# Altium project OSP_Carrier_V7_Release.PrjPcb (part 1 of 2)
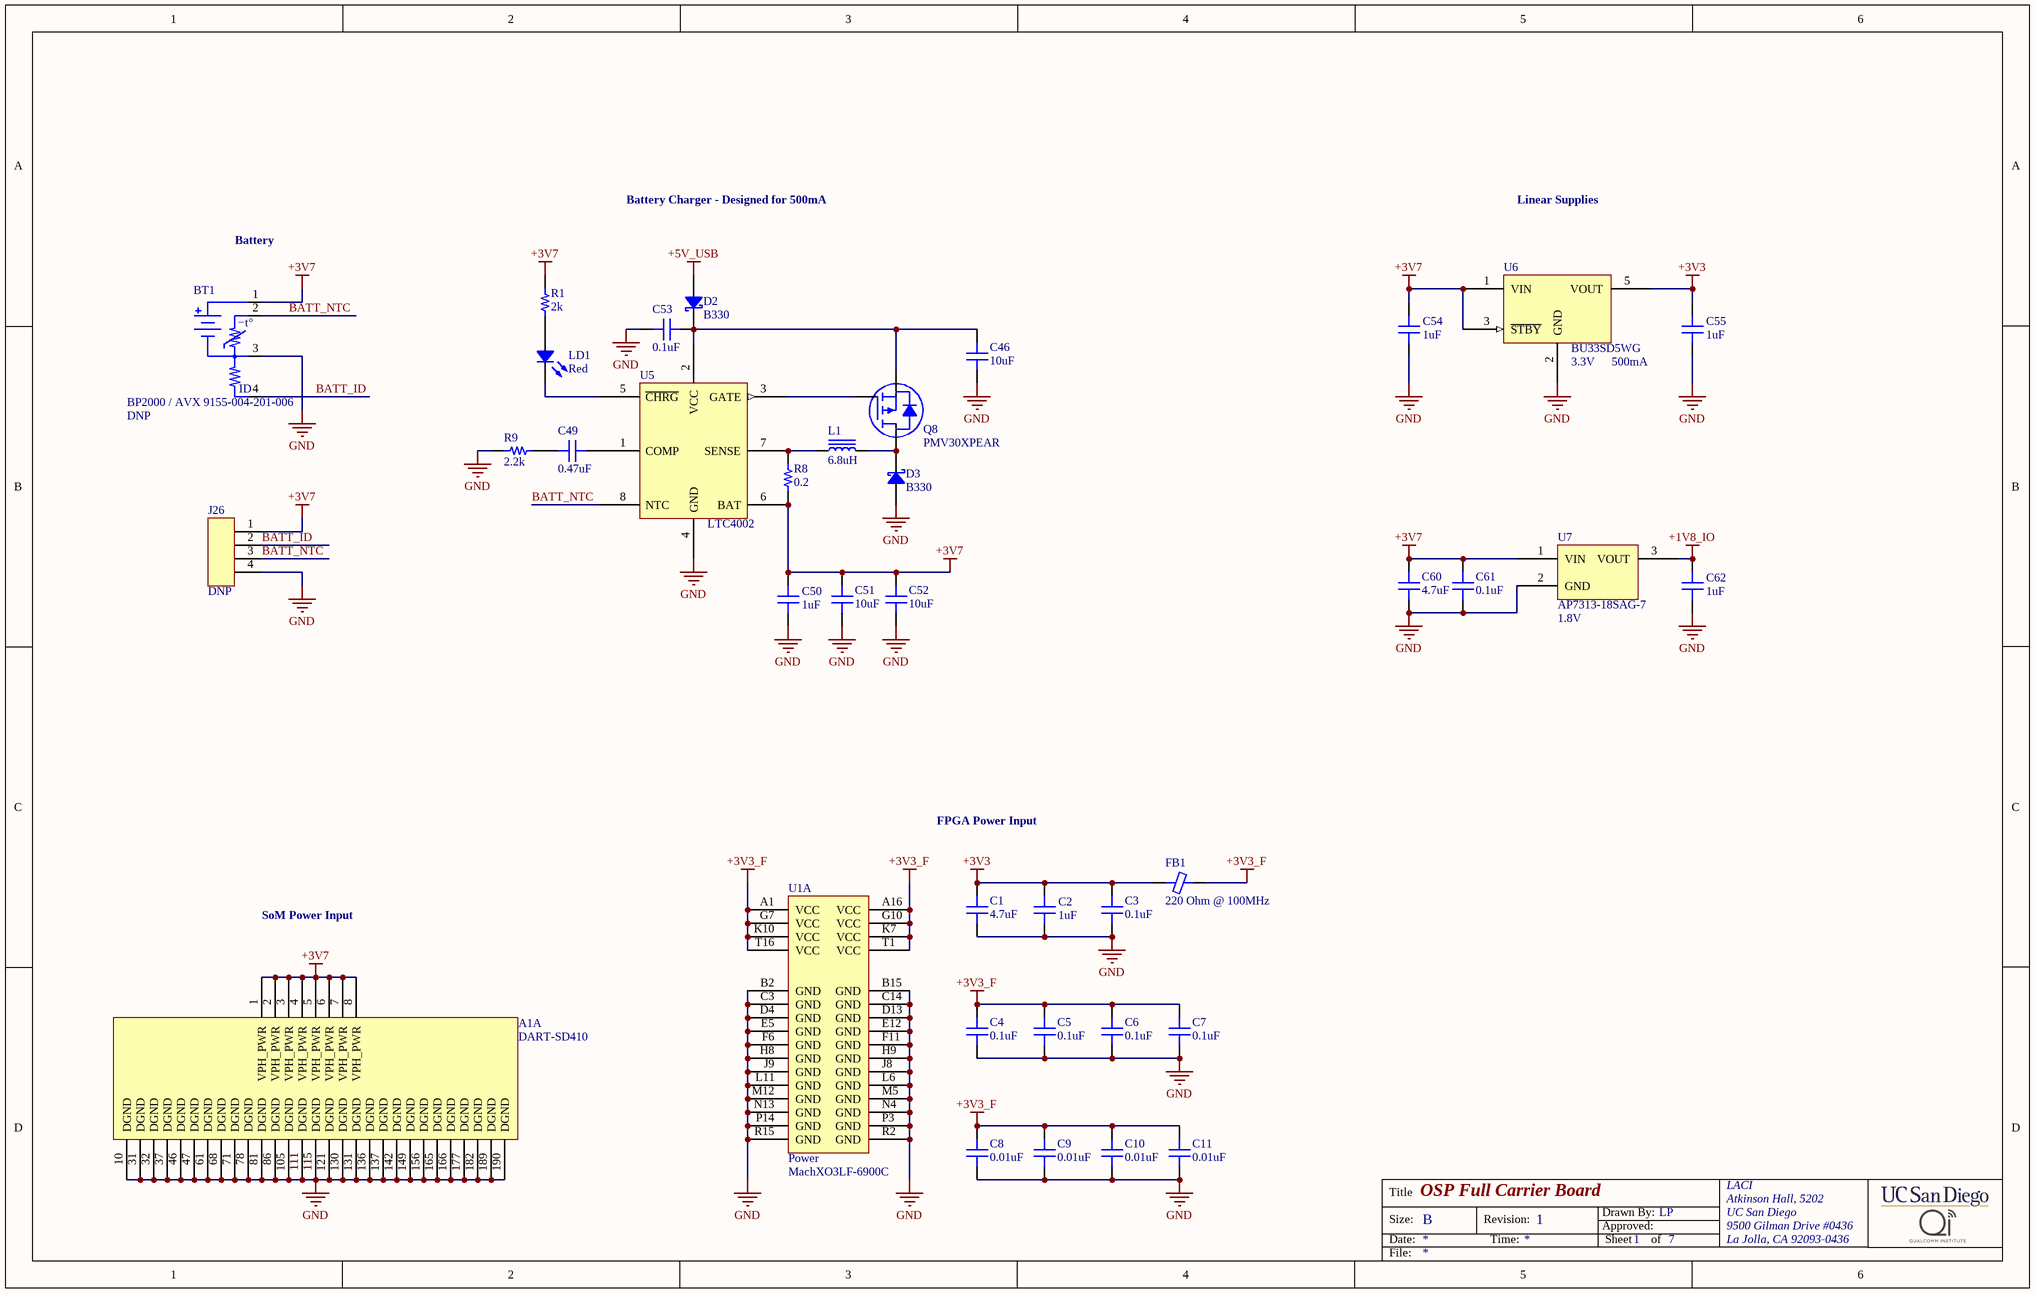
[diagram p0: OSP_Carrier_V7_Release_Power.SchDoc]
6 sheets, 153 parts. Net scope: global (net labels, ports and power ports of the same name join across sheets).
Board file: OSP_Carrier_V7_Release.PcbDoc
Sheets:
  OSP_Carrier_V7_Release_Power.SchDoc
  OSP_Carrier_V7_Release_DJB.SchDoc
  OSP_Carrier_V7_Release_USB.SchDoc
  OSP_Carrier_V7_Release_PMIC_Audio.SchDoc
  OSP_Carrier_V7_Release_Misc.SchDoc
  OSP_Carrier_V7_Release_SD.SchDoc

## Sheet OSP_Carrier_V7_Release_Power.SchDoc: OSP Full Carrier Board
size B; DrawnBy: LP; Revision: 1; SheetNumber: 1; SheetTotal: 7; DocumentName: OSP Full Carrier Board

### Parts
A1  DART-SD410  [DART-SD410]  (part A of 15)
BT1  BP2000 / AVX 9155-004-201-006  [SAMSUNG_BP2000]
C1  4.7uF  [CAP 0402/1005]
C2  1uF  [CAP 0402/1005]
C3  0.1uF  [CAP 0402/1005]
C4  0.1uF  [CAP 0402/1005]
C5  0.1uF  [CAP 0402/1005]
C6  0.1uF  [CAP 0402/1005]
C7  0.1uF  [CAP 0402/1005]
C8  0.01uF  [CAP 0402/1005]
C9  0.01uF  [CAP 0402/1005]
C10  0.01uF  [CAP 0402/1005]
C11  0.01uF  [CAP 0402/1005]
C46  10uF  [CAP 1206/3216]
C49  0.47uF  [CAP 0402/1005]
C50  1uF  [CAP 0402/1005]
C51  10uF  [CAP 1206/3216]
C52  10uF  [CAP 1206/3216]
C53  0.1uF  [CAP 0402/1005]
C54  1uF  [CAP 0402/1005]
C55  1uF  [CAP 0402/1005]
C60  4.7uF  [CAP 0402/1005]
C61  0.1uF  [CAP 0402/1005]
C62  1uF  [CAP 0402/1005]
D2  B330  [DO214AC SMA]
D3  B330  [DO214AC SMA]
FB1  220 Ohm @ 100MHz  [FER 0402/1005]
J26  Shallow  [AMPHENOL_10125839-04RAEHLF_DNP]  (value not drawn)
L1  6.8uH  [LAIRD_TYS6028]
LD1  Red  [LED 0603/1608 RED]
Q8  PMV30XPEAR  [NXP_SOT23]
R1  2k  [RES 0402/1005]
R8  0.2  [STACKPOLE CSR1206]
R9  2.2k  [RES 0402/1005]
U1  MachXO3LF-6900C  [LCMXO3_caBGA_BG256]  (part A of 7)
U5  LTC4002  [AD_LT_S8]
U6  BU33SD5WG  VOLTAGE: 3.3V  CURRENT: 500mA  [ROHM_SSOP5]
U7  AP7313-18SAG-7  Voltage - Output: 1.8V  [DIODES SOT-23-3]

### Nets
+1V8_IO: C62.1 U7.3(VOUT)
+3V3: C1.2 C2.1 C3.2 C55.1 FB1.1 U6.5(VOUT)
+3V3_F: C4.2 C5.2 C6.2 C7.2 C8.2 C9.2 C10.2 C11.2 FB1.2 U1.A1(VCC) U1.A16(VCC) U1.G7(VCC) U1.G10(VCC) U1.K7(VCC) U1.K10(VCC) U1.T1(VCC) U1.T16(VCC)
+3V7: A1.1(VPH_PWR) A1.2(VPH_PWR) A1.3(VPH_PWR) A1.4(VPH_PWR) A1.5(VPH_PWR) A1.6(VPH_PWR) A1.7(VPH_PWR) A1.8(VPH_PWR) BT1.1(+) C50.1 C51.1 C52.1 C54.1 C60.2 C61.2 J26.1 R1.2 R8.1 U5.6(BAT) U6.1(VIN) U6.3(~{STBY}) U7.1(VIN)
+5V_USB: D2.1
GND: A1.10(DGND) A1.31(DGND) A1.32(DGND) A1.37(DGND) A1.46(DGND) A1.47(DGND) A1.61(DGND) A1.68(DGND) A1.71(DGND) A1.78(DGND) A1.81(DGND) A1.86(DGND) A1.105(DGND) A1.111(DGND) A1.115(DGND) A1.121(DGND) A1.130(DGND) A1.131(DGND) A1.136(DGND) A1.137(DGND) A1.142(DGND) A1.149(DGND) A1.156(DGND) A1.165(DGND) A1.166(DGND) A1.177(DGND) A1.182(DGND) A1.189(DGND) A1.190(DGND) BT1.3(−) C1.1 C2.2 C3.1 C4.1 C5.1 C6.1 C7.1 C8.1 C9.1 C10.1 C11.1 C46.2 C50.2 C51.2 C52.2 C53.2 C54.2 C55.2 C60.1 C61.1 C62.2 D3.1 J26.4 R9.2 U1.B2(GND) U1.B15(GND) U1.C3(GND) U1.C14(GND) U1.D4(GND) U1.D13(GND) U1.E5(GND) U1.E12(GND) U1.F6(GND) U1.F11(GND) U1.H8(GND) U1.H9(GND) U1.J8(GND) U1.J9(GND) U1.L6(GND) U1.L11(GND) U1.M5(GND) U1.M12(GND) U1.N4(GND) U1.N13(GND) U1.P3(GND) U1.P14(GND) U1.R2(GND) U1.R15(GND) U5.4(GND) U6.2(GND) U7.2(GND)
BATT_ID: BT1.4(ID) J26.2
BATT_NTC: BT1.2(NTC) J26.3 U5.8(NTC)
NetC46_1: C46.1 C53.1 D2.2 Q8.2(S) U5.2(VCC)
NetC49_1: C49.1 U5.1(COMP)
NetC49_2: C49.2 R9.1
NetD3_2: D3.2 L1.2 Q8.3(D)
NetL1_1: L1.1 R8.2 U5.7(SENSE)
NetLD1_1: LD1.1 R1.1
NetLD1_2: LD1.2 U5.5(~{CHRG})
NetQ8_1: Q8.1(G) U5.3(GATE)

### Notes on the sheet
- Battery Charger - Designed for 500mA
- Linear Supplies
- Battery
- FPGA Power Input
- SoM Power Input
- Title
- Size:
- Date:
- B
- Revision:
- Time:
- Drawn By:
- Approved:
- Sheet
- of
- LACI
- Atkinson Hall, 5202
- UC San Diego
- 9500 Gilman Drive #0436
- La Jolla, CA 92093-0436
- File:
- (in symbol LCMXO3LF-6900C-XBG256X, part A) Power
- (in symbol SAMSUNG_BP2000) −t°

### Library data of the parts
A1 = DART-SD410: Variscite DART-SD410 System on Module
BT1 = SAMSUNG_BP2000: Samsung BP2000 2000mAh battery for Galaxy Camera 2, connector AVX 9155-004-201-006; DNP: DNP
C1 C60 = C1005X5R1A475K050BC: CAP CER 4.7UF 10V X5R 0402; Manufacturer: TDK Corporation; TemperatureRange: -55C ~ 85C; Tolerance: 10%; Value: 4.7uF; Part Number: C1005X5R1A475K050BC; PartId: 12382; Supplier 1: Digi-Key; Supplier Part Number 1: 445-13820-2-ND; ComponentLink1Description: Datasheet; ComponentLink1URL: https://product.tdk.com/info/en/catalog/datasheets/mlcc_commercial_general_en.pdf; ComponentLink2Description: Digi-Key Listing; ComponentLink2URL: https://www.digikey.com/product-detail/en/tdk-corporation/C1005X5R1A475K050BC/445-13820-2-ND/3951056; TemperatureCoefficient: X5R; Voltage: 10V; Price: 0.096; Device Package: 0402 (1005 Metric)
C2 C50 C54 C55 C62 = GRM155R61A105KE15D: CAP CER 1UF 10V X5R 0402; Manufacturer: Murata Electronics North America; TemperatureRange: -55C ~ 85C; Tolerance: 10%; Value: 1uF; Part Number: GRM155R61A105KE15D; PartId: 12338; Supplier 1: Digi-Key; Supplier Part Number 1: 490-3890-2-ND; ComponentLink1Description: Datasheet; ComponentLink1URL: http://www.murata.com/~/media/webrenewal/support/library/catalog/products/capacitor/mlcc/c02e.pdf; ComponentLink2Description: Digi-Key Listing; ComponentLink2URL: https://www.digikey.com/product-detail/en/murata-electronics-north-america/GRM155R61A105KE15D/490-3890-2-ND/965904; TemperatureCoefficient: X5R; Voltage: 10V; Price: 0.0069; Device Package: 0402 (1005 Metric)
C3-C7 C53 C61 = C1005X7R1H104K050BB: CAP CER 0.1UF 50V X7R 0402; Manufacturer: TDK Corporation; TemperatureRange: -55C ~ 125C; Tolerance: 10%; Value: 0.1uF; Part Number: C1005X7R1H104K050BB; PartId: 3860; Supplier 1: Digi-Key; Supplier Part Number 1: 445-5932-2-ND; ComponentLink1Description: Datasheet; ComponentLink1URL: https://product.tdk.com/info/en/catalog/datasheets/mlcc_commercial_general_en.pdf; ComponentLink2Description: Digi-Key listing; ComponentLink2URL: http://digikey.com/product-detail/en/C1005X7R1H104K050BB/445-5932-2-ND/2443410; TemperatureCoefficient: X7R; Voltage: 50V; Price: 0.0287; Type: -; Device Package: 0402 (1005 Metric)
C8-C11 = CC0402KRX7R8BB103: CAP CER 10000PF 25V X7R 0402; Manufacturer: Yageo; TemperatureRange: -55C ~ 125C; Tolerance: 10%; Value: 0.01uF; Part Number: CC0402KRX7R8BB103; PartId: 12361; Supplier 1: Digi-Key; Supplier Part Number 1: 311-1337-2-ND; ComponentLink1Description: Datasheet; ComponentLink1URL: http://www.yageo.com/documents/recent/UPY-GPHC_X7R_6.3V-to-50V_13.pdf; ComponentLink2Description: Digi-Key Listing; ComponentLink2URL: https://www.digikey.com/product-detail/en/yageo/CC0402KRX7R8BB103/311-1337-2-ND/2103075; TemperatureCoefficient: X7R; Voltage: 25V; Price: 0.0017; Device Package: 0402 (1005 Metric)
C46 C51 C52 = C1206C106M3RACTU: CAP CER 10UF 25V X7R 1206; Manufacturer: Kemet; TemperatureRange: -55C ~ 125C; Tolerance: 20%; Value: 10uF; Part Number: C1206C106M3RACTU; PartId: 6235; Supplier 1: Digi-Key; Supplier Part Number 1: 399-7443-2-ND; ComponentLink1Description: Datasheet; ComponentLink1URL: http://www.kemet.com/docfinder?Partnumber=C1206C106M3RACTU; ComponentLink2Description: Digi-Key listing; ComponentLink2URL: http://digikey.com/product-detail/en/C1206C106M3RACTU/399-7443-2-ND/3317649; TemperatureCoefficient: X7R; Voltage: 25V; Price: 0.2272; Type: -; Device Package: 1206 (3216 Metric)
C49 = GRM155R61A474KE15D: CAP CER 0.47UF 10V X5R 0402; Manufacturer: Murata Electronics North America; TemperatureRange: -55C ~ 85C; Tolerance: 10%; Value: 0.47uF; Part Number: GRM155R61A474KE15D; PartId: 12351; Supplier 1: Digi-Key; Supplier Part Number 1: 490-3264-2-ND; ComponentLink1Description: Datasheet; ComponentLink1URL: http://www.murata.com/~/media/webrenewal/support/library/catalog/products/capacitor/mlcc/c02e.pdf; ComponentLink2Description: Digi-Key Listing; ComponentLink2URL: https://www.digikey.com/product-detail/en/murata-electronics-north-america/GRM155R61A474KE15D/490-3264-2-ND/702528; TemperatureCoefficient: X5R; Voltage: 10V; Price: 0.0121; Device Package: 0402 (1005 Metric)
D2 D3 = B330A: B330AE-13 Schottky Diode 3A 30V
FB1 = CIM05U221NC: FERRITE CHIP 220 OHM 500MA 0402; Manufacturer: Samsung Electro-Mechanics America, Inc.; Type: Differential Mode - Single; DC Resistance: 350 mOhm Max; Part Number: CIM05U221NC; PartId: 6444; Value: 220 Ohm @ 100MHz; Supplier 1: Digi-Key; Supplier Part Number 1: 1276-6344-2-ND; ComponentLink1Description: Datasheet; ComponentLink1URL: http://www.samsungsem.com/kr/front/downloadcms.do?path=/kr/support/product-search/bead/__icsFiles/afieldfile/2014/11/13&fileName=S_CIM05J102NC.pdf; ComponentLink2Description: Digi-Key listing; ComponentLink2URL: http://digikey.com/product-detail/en/CIM05U221NC/1276-6344-2-ND/3973776; Price: 0.0073; Device Package: 0402 (1005 Metric); Current Rating: 500mA
J26 = AMPHENOL_10125839-04RAEHLF_DNP: Amphenol 10125839-04RAEHLF (Do Not Populate); DNP: DNP
L1 = Laird_TYS60286R8M-10: Laird TYS60286R8M-10 6.8uH 2.4A 47mOhms
LD1 = LTST-C191KRKT: LED RED CLEAR 0603 SMD; Manufacturer: Lite-On Inc.; Value: Green; Millicandela: 54mcd; Voltage Forward: 2V; Current (Test): 20mA; Viewing Angle: 130; Part Number: LTST-C191KRKT; PartId: 7050; Supplier 1: Digi-Key; Supplier Part Number 1: 160-1447-2-ND; ComponentLink1Description: Datasheet; ComponentLink1URL: http://optoelectronics.liteon.com/upload/download/DS22-2000-223/S_110_LTST-C191KRKT.pdf; ComponentLink2Description: Digi-Key Listing; ComponentLink2URL: http://www.digikey.ca/product-detail/en/LTST-C191KRKT/160-1447-2-ND/386837; Price: 0.0521; Device Package: 0603 (1608 Metric); Colour: Red; Lens Transparency: Clear
Q8 = NXP_PMV30XPEAR: PMV30XPEAR PMOS 20V -5.3A 28mOhms
R1 = ERJ-2RKF2001X: RES SMD 2K OHM 1% 1/10W 0402; Manufacturer: Panasonic Electronic Components; TemperatureRange: -55C ~ 155C; TemperatureCoefficient: 100ppm/C; PowerRating: 0.1W, 1/10W; Value: 2k; Part Number: ERJ-2RKF2001X; PartId: 16; Supplier 1: Digi-Key; Supplier Part Number 1: P2.00KLTR-ND; ComponentLink1Description: Datasheet; ComponentLink1URL: http://industrial.panasonic.com/www-cgi/jvcr13pz.cgi?E+PZ+3+AOA0002+ERJ2RKF2001X+7+WW; ComponentLink2Description: Digikey listing; ComponentLink2URL: http://digikey.com/product-detail/en/ERJ-2RKF2001X/P2.00KLTR-ND/192194; Tolerance: 1%; Price: 0.0043; Type: Thick Film; Device Package: 0402 (1005 Metric)
R8 = CSR1206FKR200: RES SMD 0.2 OHM 1% 1/2W 1206; Manufacturer: Stackpole Electronics Inc.; TemperatureRange: -55C ~ 155C; TemperatureCoefficient: 100ppm/C; PowerRating: 0.5W, 1/2W; Value: 0.2; Part Number: CSR1206FKR200; PartId: 9964; Supplier 1: Digi-Key; Supplier Part Number 1: CSR1206FKR200TR-ND; ComponentLink1Description: Datasheet; ComponentLink1URL: http://www.seielect.com/catalog/SEI-CSR_CSRN.pdf; ComponentLink2Description: Digi-Key Listing; ComponentLink2URL: https://www.digikey.com/product-detail/en/stackpole-electronics-inc/CSR1206FKR200/CSR1206FKR200TR-ND/1742391; Tolerance: 1%; Price: 0.072; Device Package: 1206 (3216 Metric)
R9 = ERJ-2RKF2201X: RES SMD 2.2K OHM 1% 1/10W 0402; Manufacturer: Panasonic Electronic Components; TemperatureRange: -55C ~ 155C; TemperatureCoefficient: 100ppm/C; PowerRating: 0.1W, 1/10W; Value: 2.2k; Part Number: ERJ-2RKF2201X; PartId: 8; Supplier 1: Digi-Key; Supplier Part Number 1: P2.20KLTR-ND; ComponentLink1Description: Datasheet; ComponentLink1URL: http://industrial.panasonic.com/www-cgi/jvcr13pz.cgi?E+PZ+3+AOA0002+ERJ2RKF2201X+7+WW; ComponentLink2Description: Digikey listing; ComponentLink2URL: http://digikey.com/product-detail/en/ERJ-2RKF2201X/P2.20KLTR-ND/1746150; Tolerance: 1%; Price: 0.0043; Type: Thick Film; Device Package: 0402 (1005 Metric)
U1 = LCMXO3LF-6900C-XBG256X: Lattice MachXO3LF-6900C-5BG256C FPGA
U5 = LTC4002: Analog / Linear 1.5A Single Cell Li-Ion Battery Charger
U6 = ROHM_BU33SD5WG: ROHM BU33SD5WG-TR 3.3V 500mA LDO
U7 = AP7313-18SAG-7: IC REG LDO 1.8V 0.15A SOT23-3; Manufacturer: Diodes Incorporated; Topology: Positive Fixed; Voltage - Input: 2 V ~ 6 V; Current - Limit (Min): 200mA; Part Number: AP7313-18SAG-7; PartId: 7912; Supplier 1: Digi-Key; Supplier Part Number 1: AP7313-18SAG-7DITR-ND; ComponentLink1Description: Datasheet; ComponentLink1URL: http://www.diodes.com/_files/datasheets/AP7313.pdf; ComponentLink2Description: Digi-Key Listing; ComponentLink2URL: http://www.digikey.ca/product-detail/en/AP7313-18SAG-7/AP7313-18SAG-7DITR-ND/2270804; Price: 0.1675; Device Package: TO-236-3, SC-59, SOT-23-3; Voltage Dropout: -; Operating Temperature: -40C ~ 85C

## Sheet OSP_Carrier_V7_Release_DJB.SchDoc: OSP Full Carrier Board
size C; DrawnBy: LP; Revision: 1; SheetNumber: 3; SheetTotal: 7
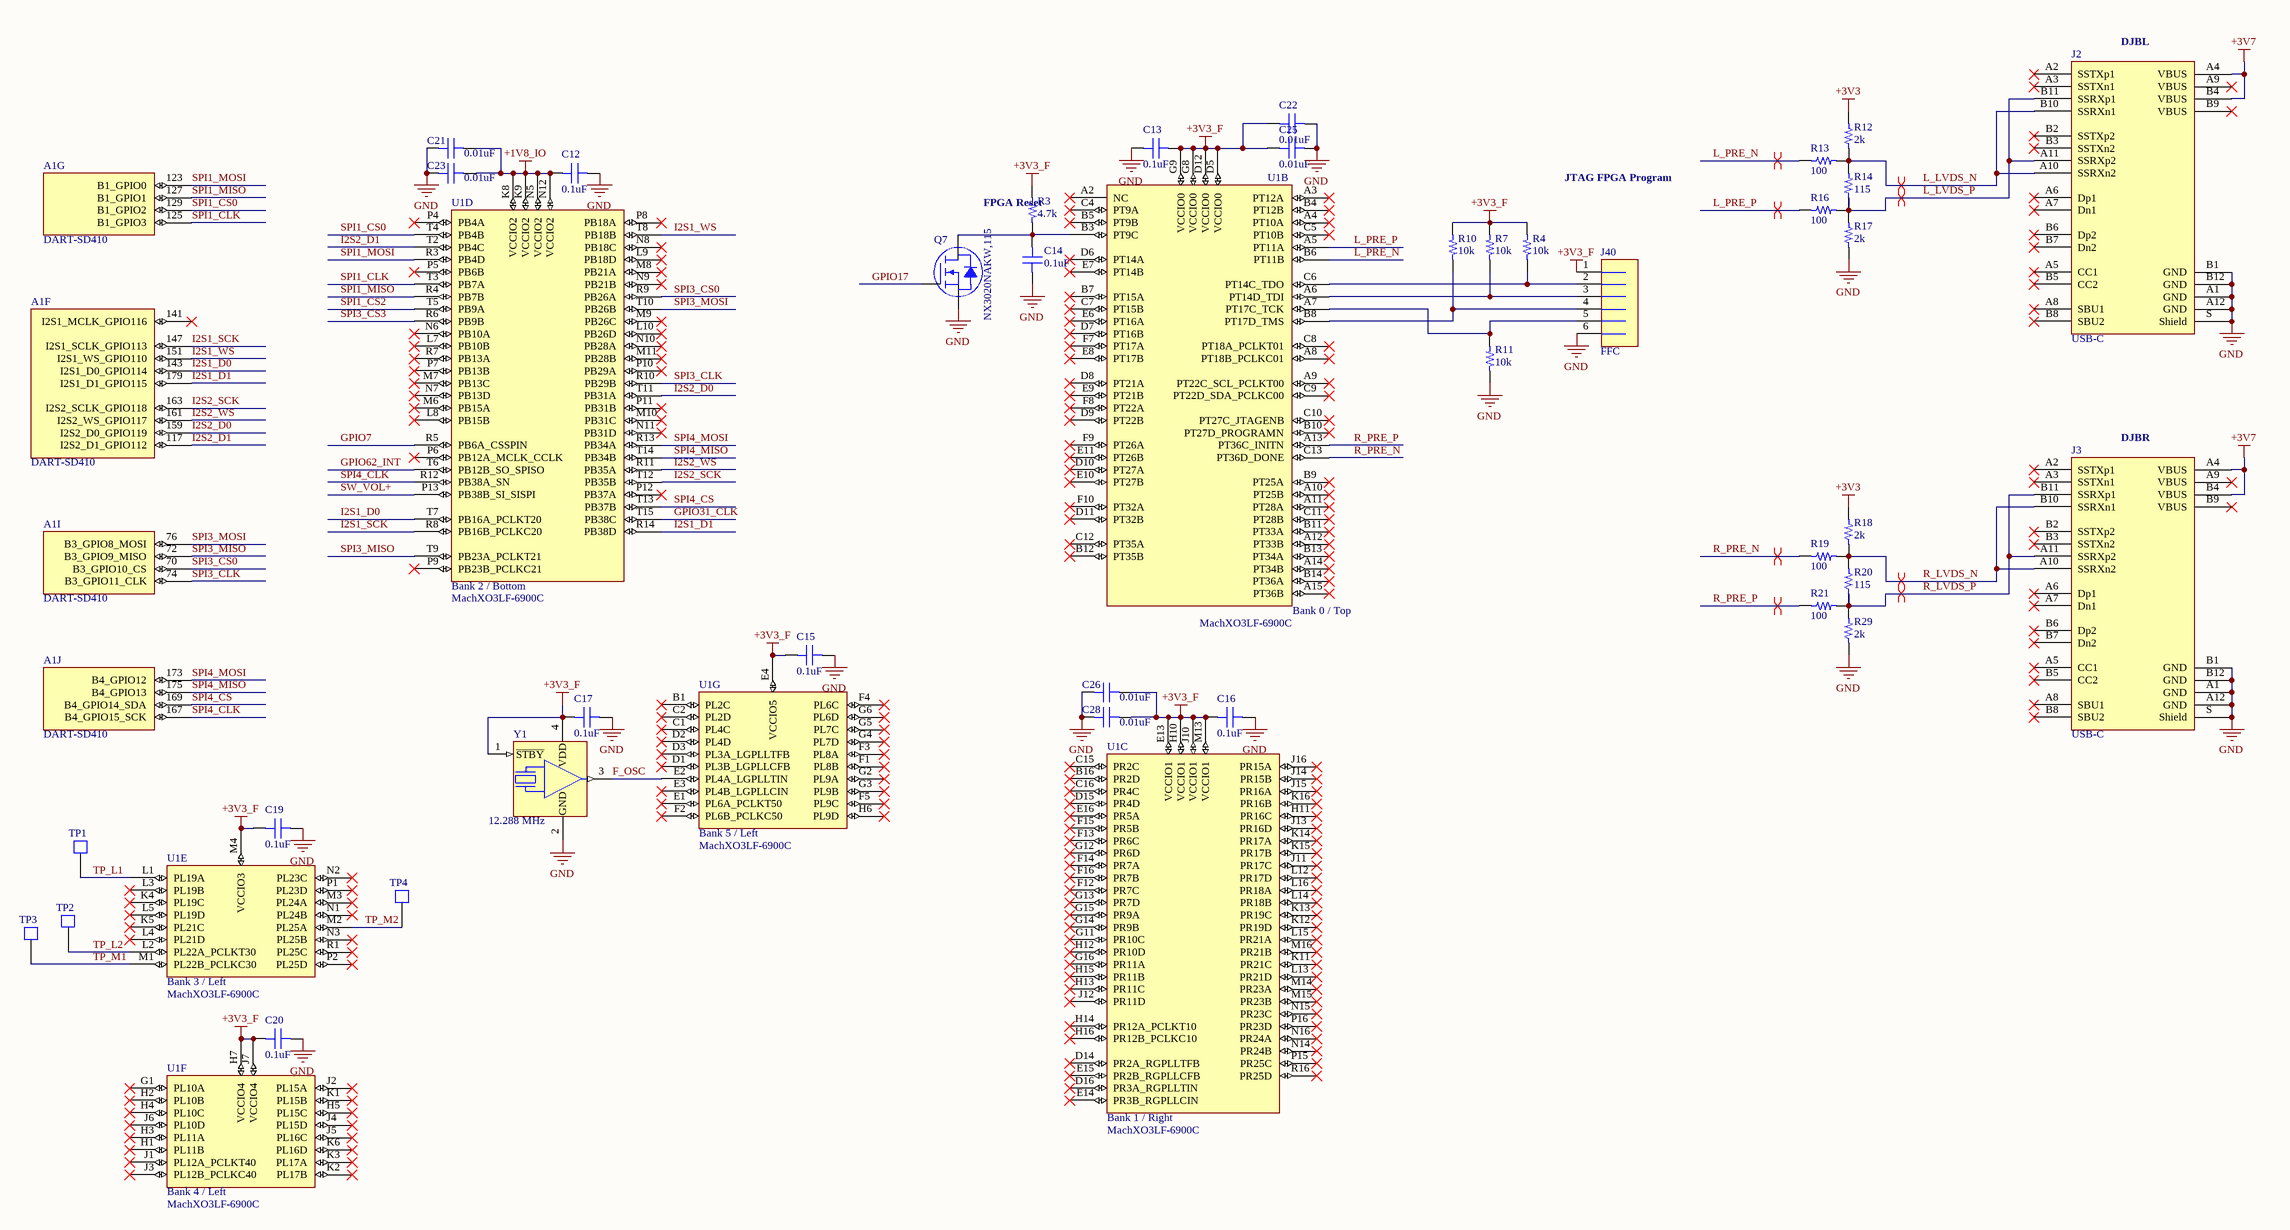
[diagram p1: OSP_Carrier_V7_Release_DJB.SchDoc]

### Parts
A1  DART-SD410  [DART-SD410]  (parts F,G,I,J of 15)
C12  0.1uF  [CAP 0402/1005]
C13  0.1uF  [CAP 0402/1005]
C14  0.1uF  [CAP 0402/1005]
C15  0.1uF  [CAP 0402/1005]
C16  0.1uF  [CAP 0402/1005]
C17  0.1uF  [CAP 0402/1005]
C19  0.1uF  [CAP 0402/1005]
C20  0.1uF  [CAP 0402/1005]
C21  0.01uF  [CAP 0402/1005]
C22  0.01uF  [CAP 0402/1005]
C23  0.01uF  [CAP 0402/1005]
C25  0.01uF  [CAP 0402/1005]
C26  0.01uF  [CAP 0402/1005]
C28  0.01uF  [CAP 0402/1005]
J2  USB-C  [TE_USB-C_2129691-1]
J3  USB-C  [TE_USB-C_2129691-1]
J40  FFC  [AMPHENOL_HFW6R-1STE1LF]
Q7  NX3020NAKW,115  [NXP SOT-323-3]
R3  4.7k  [RES 0402/1005]
R4  10k  [RES 0402/1005]
R7  10k  [RES 0402/1005]
R10  10k  [RES 0402/1005]
R11  10k  [RES 0402/1005]
R12  2k  [RES 0402/1005]
R13  100  [RES 0402/1005]
R14  115  [RES 0402/1005]
R16  100  [RES 0402/1005]
R17  2k  [RES 0402/1005]
R18  2k  [RES 0402/1005]
R19  100  [RES 0402/1005]
R20  115  [RES 0402/1005]
R21  100  [RES 0402/1005]
R29  2k  [RES 0402/1005]
TP1  TP_SMD_1MM_SQ  [TP_SMD_1MM_SQ]  (value not drawn)
TP2  TP_SMD_1MM_SQ  [TP_SMD_1MM_SQ]  (value not drawn)
TP3  TP_SMD_1MM_SQ  [TP_SMD_1MM_SQ]  (value not drawn)
TP4  TP_SMD_1MM_SQ  [TP_SMD_1MM_SQ]  (value not drawn)
U1  MachXO3LF-6900C  [LCMXO3_caBGA_BG256]  (parts B,C,D,E,F,G of 7)
Y1  12.288 MHz  [OSC_2.5x2.0mm]

### Nets
+1V8_IO: C12.2 C21.1 C23.1 U1.K8(VCCIO2) U1.K9(VCCIO2) U1.N5(VCCIO2) U1.N12(VCCIO2)
+3V3: R12.2 R18.2
+3V3_F: C13.2 C15.2 C16.2 C17.2 C19.2 C20.2 C22.1 C25.1 C26.1 C28.1 J40.1 R3.2 R4.2 R7.2 R10.2 U1.D5(VCCIO0) U1.D12(VCCIO0) U1.E4(VCCIO5) U1.E13(VCCIO1) U1.G8(VCCIO0) U1.G9(VCCIO0) U1.H7(VCCIO4) U1.H10(VCCIO1) U1.J7(VCCIO4) U1.J10(VCCIO1) U1.M4(VCCIO3) U1.M13(VCCIO1) Y1.1(~{STBY}) Y1.4(VDD)
+3V7: J2.A4(VBUS) J2.B4(VBUS) J3.A4(VBUS) J3.B4(VBUS)
GND: C12.1 C13.1 C14.2 C15.1 C16.1 C17.1 C19.1 C20.1 C21.2 C22.2 C23.2 C25.2 C26.2 C28.2 J2.A1(GND) J2.A12(GND) J2.B1(GND) J2.B12(GND) J2.S(Shield) J3.A1(GND) J3.A12(GND) J3.B1(GND) J3.B12(GND) J3.S(Shield) J40.6 Q7.3(S) R11.1 R17.1 R29.1 Y1.2(GND)
F_OSC: U1.E2(PL4A_LGPLLTIN) Y1.3(OUT)
GPIO7: U1.R5(PB6A_CSSPIN)
GPIO17: Q7.1(G)
GPIO31_CLK: U1.T15(PB38C)
GPIO62_INT: U1.T6(PB12B_SO_SPISO)
I2S1_D0: A1.143(I2S1_D0_GPIO114) U1.T7(PB16A_PCLKT20)
I2S1_D1: A1.179(I2S1_D1_GPIO115) U1.R14(PB38D)
I2S1_SCK: A1.147(I2S1_SCLK_GPIO113) U1.R8(PB16B_PCLKC20)
I2S1_WS: A1.151(I2S1_WS_GPIO110) U1.T8(PB18B)
I2S2_D0: A1.159(I2S2_D0_GPIO119) U1.T11(PB31A)
I2S2_D1: A1.117(I2S2_D1_GPIO112) U1.T2(PB4C)
I2S2_SCK: A1.163(I2S2_SCLK_GPIO118) U1.T12(PB35B)
I2S2_WS: A1.161(I2S2_WS_GPIO117) U1.R11(PB35A)
L_LVDS_N: J2.A10(SSRXn2) J2.B10(SSRXn1) R12.1 R13.2 R14.2
L_LVDS_P: J2.A11(SSRXp2) J2.B11(SSRXp1) R14.1 R16.2 R17.2
L_PRE_N: R13.1 U1.B6(PT11B)
L_PRE_P: R16.1 U1.A5(PT11A)
R_LVDS_N: J3.A10(SSRXn2) J3.B10(SSRXn1) R18.1 R19.2 R20.2
R_LVDS_P: J3.A11(SSRXp2) J3.B11(SSRXp1) R20.1 R21.2 R29.2
R_PRE_N: R19.1 U1.C13(PT36D_DONE)
R_PRE_P: R21.1 U1.A13(PT36C_INITN)
SPI1_CLK: A1.125(B1_GPIO3) U1.T3(PB7A)
SPI1_CS0: A1.129(B1_GPIO2) U1.T4(PB4B)
SPI1_CS2: U1.T5(PB9A)
SPI1_MISO: A1.127(B1_GPIO1) U1.R4(PB7B)
SPI1_MOSI: A1.123(B1_GPIO0) U1.R3(PB4D)
SPI3_CLK: A1.74(B3_GPIO11_CLK) U1.R10(PB29B)
SPI3_CS0: A1.70(B3_GPIO10_CS) U1.R9(PB26A)
SPI3_CS3: U1.R6(PB9B)
SPI3_MISO: A1.72(B3_GPIO9_MISO) U1.T9(PB23A_PCLKT21)
SPI3_MOSI: A1.76(B3_GPIO8_MOSI) U1.T10(PB26B)
SPI4_CLK: A1.167(B4_GPIO15_SCK) U1.R12(PB38A_SN)
SPI4_CS: A1.169(B4_GPIO14_SDA) U1.T13(PB37B)
SPI4_MISO: A1.175(B4_GPIO13) U1.T14(PB34B)
SPI4_MOSI: A1.173(B4_GPIO12) U1.R13(PB34A)
SW_VOL+: U1.P13(PB38B_SI_SISPI)
TP_L1: TP1.1 U1.L1(PL19A)
TP_L2: TP2.1 U1.L2(PL22A_PCLKT30)
TP_M1: TP3.1 U1.M1(PL22B_PCLKC30)
TP_M2: TP4.1 U1.M2(PL25A)
NetC14_1: C14.1 Q7.2(D) R3.1 U1.B3(PT9C)
NetJ40_2: J40.2 R4.1 U1.C6(PT14C_TDO)
NetJ40_3: J40.3 R7.1 U1.A6(PT14D_TDI)
NetJ40_4: J40.4 R10.1 U1.B8(PT17D_TMS)
NetJ40_5: J40.5 R11.2 U1.A7(PT17C_TCK)

Not connected (* = marked no-connect by the designer): A1 141(I2S1_MCLK_GPIO116)*; J2 A2(SSTXp1)* A3(SSTXn1)* A5(CC1)* A6(Dp1)* A7(Dn1)* A8(SBU1)* A9(VBUS)* B2(SSTXp2)* B3(SSTXn2)* B5(CC2)* B6(Dp2)* B7(Dn2)* B8(SBU2)* B9(VBUS)*; J3 A2(SSTXp1)* A3(SSTXn1)* A5(CC1)* A6(Dp1)* A7(Dn1)* A8(SBU1)* A9(VBUS)* B2(SSTXp2)* B3(SSTXn2)* B5(CC2)* B6(Dp2)* B7(Dn2)* B8(SBU2)* B9(VBUS)*; U1 A2(NC)* A3(PT12A)* A4(PT10A)* A8(PT18B_PCLKC01)* A9(PT22C_SCL_PCLKT00)* A10(PT25B)* A11(PT28A)* A12(PT33B)* A14(PT34B)* A15(PT36B)* B1(PL2C)* B4(PT12B)* B5(PT9B)* B7(PT15A)* B9(PT25A)* B10(PT27D_PROGRAMN)* B11(PT33A)* B12(PT35B)* B13(PT34A)* B14(PT36A)* B16(PR2D)* C1(PL4C)* C2(PL2D)* C4(PT9A)* C5(PT10B)* C7(PT15B)* C8(PT18A_PCLKT01)* C9(PT22D_SDA_PCLKC00)* C10(PT27C_JTAGENB)* C11(PT28B)* C12(PT35A)* C15(PR2C)* C16(PR4C)* D1(PL3B_LGPLLCFB)* D2(PL4D)* D3(PL3A_LGPLLTFB)* D6(PT14A)* D7(PT16B)* D8(PT21A)* D9(PT22B)* D10(PT27A)* D11(PT32B)* D14(PR2A_RGPLLTFB)* D15(PR4D)* D16(PR3A_RGPLLTIN)* E1(PL6A_PCLKT50)* E3(PL4B_LGPLLCIN)* E6(PT16A)* E7(PT14B)* E8(PT17B)* E9(PT21B)* E10(PT27B)* E11(PT26B)* E14(PR3B_RGPLLCIN)* E15(PR2B_RGPLLCFB)* E16(PR5A)* F1(PL8B)* F2(PL6B_PCLKC50)* F3(PL8A)* F4(PL6C)* F5(PL9C)* F7(PT17A)* F8(PT22A)* F9(PT26A)* F10(PT32A)* F12(PR7C)* F13(PR6C)* F14(PR7A)* F15(PR5B)* F16(PR7B)* G1(PL10A)* G2(PL9A)* G3(PL9B)* G4(PL7D)* G5(PL7C)* G6(PL6D)* G11(PR10C)* G12(PR6D)* G13(PR7D)* G14(PR9B)* G15(PR9A)* G16(PR11A)* H1(PL11B)* H2(PL10B)* H3(PL11A)* H4(PL10C)* H5(PL15C)* H6(PL9D)* H11(PR16C)* H12(PR10D)* H13(PR11C)* H14(PR12A_PCLKT10)* H15(PR11B)* H16(PR12B_PCLKC10)* J1(PL12A_PCLKT40)* J2(PL15A)* J3(PL12B_PCLKC40)* J4(PL15D)* J5(PL16C)* J6(PL10D)* J11(PR17C)* J12(PR11D)* J13(PR16D)* J14(PR15B)* J15(PR16A)* J16(PR15A)* K1(PL15B)* K2(PL17B)* K3(PL17A)* K4(PL19C)* K5(PL21C)* K6(PL16D)* K11(PR21C)* K12(PR19D)* K13(PR19C)* K14(PR17A)* K15(PR17B)* K16(PR16B)* L3(PL19B)* L4(PL21D)* L5(PL19D)* L7(PB10B)* L8(PB15B)* L9(PB18D)* L10(PB26D)* L12(PR17D)* L13(PR21D)* L14(PR18B)* L15(PR21A)* L16(PR18A)* M3(PL24A)* M6(PB15A)* M7(PB13C)* M8(PB21A)* M9(PB26C)* M10(PB31C)* M11(PB28B)* M14(PR23A)* M15(PR23B)* M16(PR21B)* N1(PL24B)* N2(PL23C)* N3(PL25B)* N6(PB10A)* N7(PB13D)* N8(PB18C)* N9(PB21B)* N10(PB28A)* N11(PB31D)* N14(PR24B)* N15(PR23C)* N16(PR24A)* P1(PL23D)* P2(PL25D)* P4(PB4A)* P5(PB6B)* P6(PB12A_MCLK_CCLK)* P7(PB13B)* P8(PB18A)* P9(PB23B_PCLKC21)* P10(PB29A)* P11(PB31B)* P12(PB37A)* P15(PR25C)* P16(PR23D)* R1(PL25C)* R7(PB13A)* R16(PR25D)*

### Layout directives
differential pair: L_LVDS_N, L_LVDS_P, L_PRE_N, L_PRE_P, R_LVDS_N, R_LVDS_P, R_PRE_N, R_PRE_P

### Notes on the sheet
- (near J2) DJBL
- FPGA Reset
- JTAG FPGA Program
- (near J3) DJBR
- Title
- Size:
- Date:
- B
- Revision:
- Time:
- Drawn By:
- Approved:
- Sheet
- of
- LACI
- Atkinson Hall, 5202
- UC San Diego
- 9500 Gilman Drive #0436
- La Jolla, CA 92093-0436
- File:
- (in symbol LCMXO3LF-6900C-XBG256X, part B) Bank 0 / Top
- (in symbol LCMXO3LF-6900C-XBG256X, part C) Bank 1 / Right
- (in symbol LCMXO3LF-6900C-XBG256X, part D) Bank 2 / Bottom
- (in symbol LCMXO3LF-6900C-XBG256X, part E) Bank 3 / Left
- (in symbol LCMXO3LF-6900C-XBG256X, part F) Bank 4 / Left
- (in symbol LCMXO3LF-6900C-XBG256X, part G) Bank 5 / Left

### Library data of the parts
A1 = DART-SD410: Variscite DART-SD410 System on Module
C12-C17 C19 C20 = C1005X7R1H104K050BB: as C3 on sheet OSP_Carrier_V7_Release_Power; Value: 0.1uF; Part Number: C1005X7R1H104K050BB; PartId: 3860; Supplier 1: Digi-Key; Supplier Part Number 1: 445-5932-2-ND; ComponentLink1Description: Datasheet; ComponentLink1URL: https://product.tdk.com/info/en/catalog/datasheets/mlcc_commercial_general_en.pdf; ComponentLink2Description: Digi-Key listing; ComponentLink2URL: http://digikey.com/product-detail/en/C1005X7R1H104K050BB/445-5932-2-ND/2443410; TemperatureCoefficient: X7R; Voltage: 50V; Price: 0.0287; Type: -; Device Package: 0402 (1005 Metric)
C21-C23 C25 C26 C28 = CC0402KRX7R8BB103: as C8 on sheet OSP_Carrier_V7_Release_Power; Value: 0.01uF; Part Number: CC0402KRX7R8BB103; PartId: 12361; Supplier 1: Digi-Key; Supplier Part Number 1: 311-1337-2-ND; ComponentLink1Description: Datasheet; ComponentLink1URL: http://www.yageo.com/documents/recent/UPY-GPHC_X7R_6.3V-to-50V_13.pdf; ComponentLink2Description: Digi-Key Listing; ComponentLink2URL: https://www.digikey.com/product-detail/en/yageo/CC0402KRX7R8BB103/311-1337-2-ND/2103075; TemperatureCoefficient: X7R; Voltage: 25V; Price: 0.0017; Device Package: 0402 (1005 Metric)
J2 J3 = TE_USB_C_2129691-1: TE 2129691-1 USB-C Socket
J40 = AMPHENOL_HFW6R-1STE1LF: Amphenol HFW6R-1STE1LF 6-pin flat flexible cable connector
Q7 = NX3020NAKW,115: MOSFET N-CH 30V 180MA SOT323; Part Number: NX3020NAKW,115
R3 = ERJ-2RKF4701X: RES SMD 4.7K OHM 1% 1/10W 0402; Manufacturer: Panasonic Electronic Components; TemperatureRange: -55C ~ 155C; TemperatureCoefficient: 100ppm/C; PowerRating: 0.1W, 1/10W; Value: 4.7k; Part Number: ERJ-2RKF4701X; PartId: 5; Supplier 1: Digi-Key; Supplier Part Number 1: P4.70KLTR-ND; ComponentLink1Description: Datasheet; ComponentLink1URL: http://industrial.panasonic.com/www-cgi/jvcr13pz.cgi?E+PZ+3+AOA0002+ERJ2RKF4701X+7+WW; ComponentLink2Description: Digikey listing; ComponentLink2URL: http://digikey.com/product-detail/en/ERJ-2RKF4701X/P4.70KLTR-ND/1746231; Tolerance: 1%; Price: 0.0043; Type: Thick Film; Device Package: 0402 (1005 Metric)
R4 R7 R10 R11 = ERJ-2RKF1002X: RES SMD 10K OHM 1% 1/10W 0402; Manufacturer: Panasonic Electronic Components; TemperatureRange: -55C ~ 155C; TemperatureCoefficient: 100ppm/C; PowerRating: 0.1W, 1/10W; Value: 10k; Part Number: ERJ-2RKF1002X; PartId: 1; Supplier 1: Digi-Key; Supplier Part Number 1: P10.0KLTR-ND; ComponentLink1Description: Datasheet; ComponentLink1URL: http://industrial.panasonic.com/www-cgi/jvcr13pz.cgi?E+PZ+3+AOA0002+ERJ2RKF1002X+7+WW; ComponentLink2Description: Digikey listing; ComponentLink2URL: http://digikey.com/product-detail/en/ERJ-2RKF1002X/P10.0KLTR-ND/192073; Tolerance: 1%; Price: 0.0043; Type: Thick Film; Device Package: 0402 (1005 Metric)
R12 R17 R18 R29 = ERJ-2RKF2001X: as R1 on sheet OSP_Carrier_V7_Release_Power; Value: 2k; Part Number: ERJ-2RKF2001X; PartId: 16; Supplier 1: Digi-Key; Supplier Part Number 1: P2.00KLTR-ND; ComponentLink1Description: Datasheet; ComponentLink1URL: http://industrial.panasonic.com/www-cgi/jvcr13pz.cgi?E+PZ+3+AOA0002+ERJ2RKF2001X+7+WW; ComponentLink2Description: Digikey listing; ComponentLink2URL: http://digikey.com/product-detail/en/ERJ-2RKF2001X/P2.00KLTR-ND/192194; Tolerance: 1%; Price: 0.0043; Type: Thick Film; Device Package: 0402 (1005 Metric)
R13 R16 R19 R21 = ERJ-2RKF1000X: RES SMD 100 OHM 1% 1/10W 0402; Manufacturer: Panasonic Electronic Components; TemperatureRange: -55C ~ 155C; TemperatureCoefficient: 100ppm/C; PowerRating: 0.1W, 1/10W; Value: 100; Part Number: ERJ-2RKF1000X; PartId: 3; Supplier 1: Digi-Key; Supplier Part Number 1: P100LTR-ND; ComponentLink1Description: Datasheet; ComponentLink1URL: http://industrial.panasonic.com/www-cgi/jvcr13pz.cgi?E+PZ+3+AOA0002+ERJ2RKF1000X+7+WW; ComponentLink2Description: Digikey listing; ComponentLink2URL: http://digikey.com/product-detail/en/ERJ-2RKF1000X/P100LTR-ND/192080; Tolerance: 1%; Price: 0.0043; Type: Thick Film; Device Package: 0402 (1005 Metric)
R14 R20 = ERJ-2RKF1150X: RES SMD 115 OHM 1% 1/10W 0402; Manufacturer: Panasonic Electronic Components; TemperatureRange: -55C ~ 155C; TemperatureCoefficient: 100ppm/C; PowerRating: 0.1W, 1/10W; Value: 115; Part Number: ERJ-2RKF1150X; PartId: 127; Supplier 1: Digi-Key; Supplier Part Number 1: P115LTR-ND; ComponentLink1Description: Datasheet; ComponentLink1URL: http://industrial.panasonic.com/www-cgi/jvcr13pz.cgi?E+PZ+3+AOA0002+ERJ2RKF1150X+7+WW; ComponentLink2Description: Digikey listing; ComponentLink2URL: http://digikey.com/product-detail/en/ERJ-2RKF1150X/P115LTR-ND/192100; Tolerance: 1%; Price: 0.0035; Type: Thick Film; Device Package: 0402 (1005 Metric)
TP1-TP4 = TP_SMD_1MM_SQ: 1mm Square SMD Test Point; DNP: DNP
U1 = LCMXO3LF-6900C-XBG256X: Lattice MachXO3LF-6900C-5BG256C FPGA
Y1 = MC_DSC1033DI2-012.2880: Microchip 12.288 MHz SMD MEMS Oscillator; DIGIKEY_PN: DSC1033DI2-012.2880-ND

## Sheet OSP_Carrier_V7_Release_USB.SchDoc: OSP Full Carrier Board
size B; DrawnBy: LP; Revision: 1; SheetNumber: 4; SheetTotal: 7
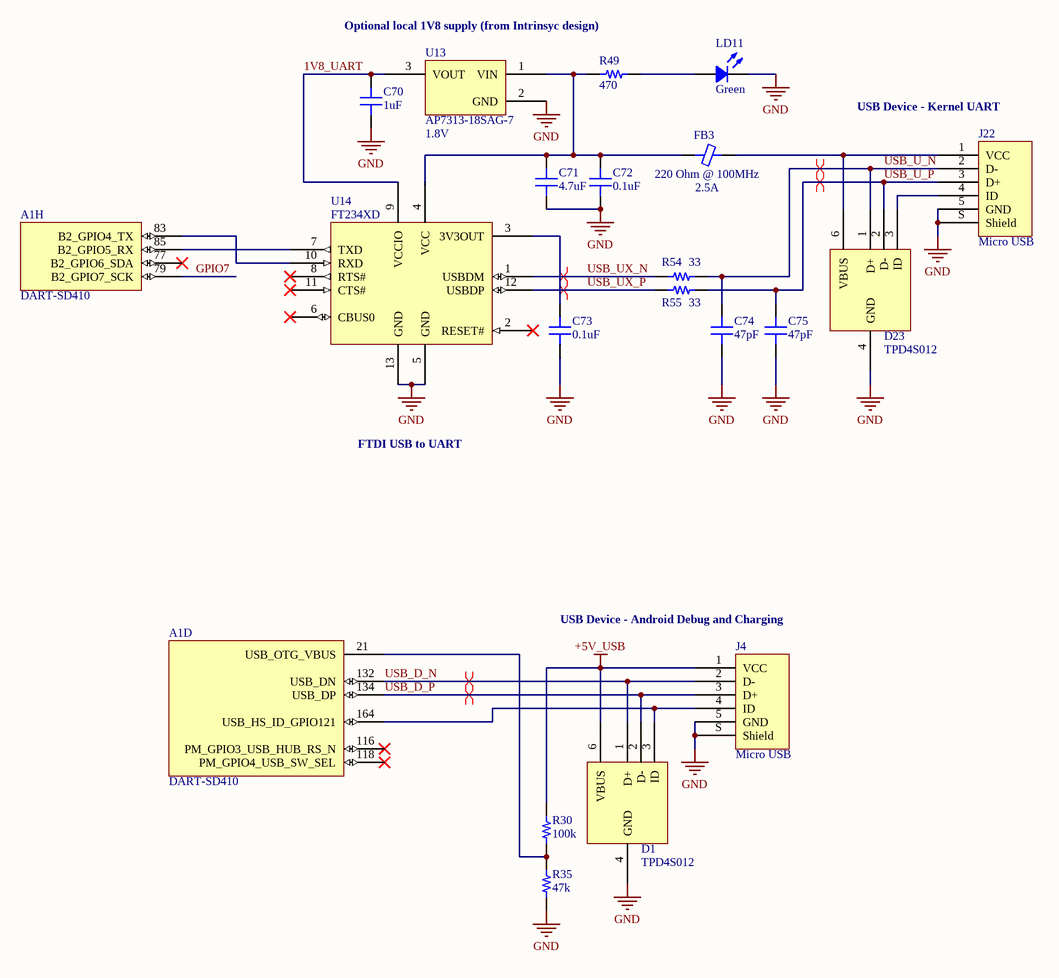
[diagram p2: OSP_Carrier_V7_Release_USB.SchDoc]

### Parts
A1  DART-SD410  [DART-SD410]  (parts D,H of 15)
C70  1uF  [CAP 0603/1608]
C71  4.7uF  [CAP 0402/1005]
C72  0.1uF  [CAP 0402/1005]
C73  0.1uF  [CAP 0402/1005]
C74  47pF  [CAP 0402/1005]
C75  47pF  [CAP 0402/1005]
D1  TPD4S012  [TI_SON6]
D23  TPD4S012  [TI_SON6]
FB3  220 Ohm @ 100MHz  Current Rating: 2.5A  [FER 0603/1608]
J4  Micro USB  [FCI USB 10118193-0001LF]
J22  Micro USB  [FCI USB 10118193-0001LF]
LD11  Green  [LED 0603/1608 GREEN]
R30  100k  [RES 0402/1005]
R35  47k  [RES 0402/1005]
R49  470  [RES 0402/1005]
R54  33  [RES 0402/1005]
R55  33  [RES 0402/1005]
U13  AP7313-18SAG-7  Voltage - Output: 1.8V  [DIODES SOT-23-3]
U14  FT234XD  [FTDI_DFN12]

### Nets
+5V_USB: D1.6(VBUS) J4.1(VCC) R30.2
GND: C70.1 C71.1 C72.1 C73.1 C74.1 C75.1 D1.4(GND) D23.4(GND) J4.5(GND) J4.S(Shield) J22.5(GND) J22.S(Shield) LD11.2 R35.1 U13.2(GND) U14.5(GND) U14.13(GND)
1V8_UART: C70.2 U13.3(VOUT) U14.9(VCCIO)
GPIO7: A1.79(B2_GPIO7_SCK)
USB_D_N: A1.132(USB_DN) D1.1(D+) J4.2(D-)
USB_D_P: A1.134(USB_DP) D1.2(D-) J4.3(D+)
USB_U_N: C74.2 D23.1(D+) J22.2(D-) R54.2
USB_U_P: C75.2 D23.2(D-) J22.3(D+) R55.2
USB_UX_N: R54.1 U14.1(USBDM)
USB_UX_P: R55.1 U14.12(USBDP)
NetA1_21: A1.21(USB_OTG_VBUS) R30.1 R35.2
NetA1_83: A1.83(B2_GPIO4_TX) U14.10(RXD)
NetA1_85: A1.85(B2_GPIO5_RX) U14.7(TXD)
NetA1_164: A1.164(USB_HS_ID_GPIO121) D1.3(ID) J4.4(ID)
NetC71_2: C71.2 C72.2 FB3.1 R49.1 U13.1(VIN) U14.4(VCC)
NetC73_2: C73.2 U14.3(3V3OUT)
NetD23_3: D23.3(ID) J22.4(ID)
NetD23_6: D23.6(VBUS) FB3.2 J22.1(VCC)
NetLD11_1: LD11.1 R49.2

Not connected (* = marked no-connect by the designer): A1 77(B2_GPIO6_SDA)* 116(PM_GPIO3_USB_HUB_RS_N)* 118(PM_GPIO4_USB_SW_SEL)*; U14 2(RESET#)* 6(CBUS0)* 8(RTS#)* 11(CTS#)*

### Layout directives
differential pair: USB_D_N, USB_D_P, USB_U_N, USB_U_P, USB_UX_N, USB_UX_P

### Notes on the sheet
- Optional local 1V8 supply (from Intrinsyc design)
- (near J22) USB Device - Kernel UART
- FTDI USB to UART
- (near J4) USB Device - Android Debug and Charging
- Title
- Size:
- Date:
- B
- Revision:
- Time:
- Drawn By:
- Approved:
- Sheet
- of
- LACI
- Atkinson Hall, 5202
- UC San Diego
- 9500 Gilman Drive #0436
- La Jolla, CA 92093-0436
- File:

### Library data of the parts
A1 = DART-SD410: Variscite DART-SD410 System on Module
C70 = C1608X7R1E105K080AB: CAP CER 1UF 25V X7R 0603; Manufacturer: TDK Corporation; TemperatureRange: -55C ~ 125C; Tolerance: 10%; Value: 1uF; Part Number: C1608X7R1E105K080AB; PartId: 4041; Supplier 1: Digi-Key; Supplier Part Number 1: 445-5956-1-ND; ComponentLink1Description: Datasheet; ComponentLink1URL: https://product.tdk.com/info/en/catalog/datasheets/mlcc_commercial_general_en.pdf; ComponentLink2Description: Digi-Key listing; ComponentLink2URL: http://digikey.com/product-detail/en/C1608X7R1E105K080AB/445-5956-1-ND/2443997; TemperatureCoefficient: X7R; Voltage: 25V; Price: 0.27; Type: -; Device Package: 0603 (1608 Metric)
C71 = C1005X5R1A475K050BC: as C1 on sheet OSP_Carrier_V7_Release_Power; Value: 4.7uF; Part Number: C1005X5R1A475K050BC; PartId: 12382; Supplier 1: Digi-Key; Supplier Part Number 1: 445-13820-2-ND; ComponentLink1Description: Datasheet; ComponentLink1URL: https://product.tdk.com/info/en/catalog/datasheets/mlcc_commercial_general_en.pdf; ComponentLink2Description: Digi-Key Listing; ComponentLink2URL: https://www.digikey.com/product-detail/en/tdk-corporation/C1005X5R1A475K050BC/445-13820-2-ND/3951056; TemperatureCoefficient: X5R; Voltage: 10V; Price: 0.096; Device Package: 0402 (1005 Metric)
C72 C73 = C1005X7R1H104K050BB: as C3 on sheet OSP_Carrier_V7_Release_Power; Value: 0.1uF; Part Number: C1005X7R1H104K050BB; PartId: 3860; Supplier 1: Digi-Key; Supplier Part Number 1: 445-5932-2-ND; ComponentLink1Description: Datasheet; ComponentLink1URL: https://product.tdk.com/info/en/catalog/datasheets/mlcc_commercial_general_en.pdf; ComponentLink2Description: Digi-Key listing; ComponentLink2URL: http://digikey.com/product-detail/en/C1005X7R1H104K050BB/445-5932-2-ND/2443410; TemperatureCoefficient: X7R; Voltage: 50V; Price: 0.0287; Type: -; Device Package: 0402 (1005 Metric)
C74 C75 = C1005C0G1H470G050BA: CAP CER 47PF 50V C0G 0402; Manufacturer: TDK Corporation; TemperatureRange: -55C ~ 125C; TemperatureCoefficient: C0G, NP0; Tolerance: 2%; Value: 47pF; Part Number: C1005C0G1H470G050BA; PartId: 3864; Supplier 1: Digi-Key; Supplier Part Number 1: 445-5364-2-ND; ComponentLink1Description: Datasheet; ComponentLink1URL: https://product.tdk.com/info/en/catalog/datasheets/mlcc_commercial_general_en.pdf; ComponentLink2Description: Digi-Key listing; ComponentLink2URL: http://digikey.com/product-detail/en/C1005C0G1H470G050BA/445-5364-2-ND/2269858; Voltage: 50V; Price: 0.1148; Type: -; Device Package: 0402 (1005 Metric)
D1 D23 = TI_TPD4S012: TI TPD4S012 USB ESD Protection
FB3 = CIS10P221NC: FERRITE CHIP 220 OHM 2500MA 0603; Manufacturer: Samsung Electro-Mechanics America, Inc.; Type: Differential Mode - Single; DC Resistance: 50 mOhm Max; Part Number: CIS10P221NC; PartId: 6665; Value: 220 Ohm @ 100MHz; Supplier 1: Digi-Key; Supplier Part Number 1: 1276-6350-2-ND; ComponentLink1Description: Datasheet; ComponentLink1URL: http://media.digikey.com/pdf/Data%20Sheets/Samsung%20PDFs/CIS10P.pdf; ComponentLink2Description: Digi-Key listing; ComponentLink2URL: http://digikey.com/product-detail/en/CIS10P221NC/1276-6350-2-ND/3973857; Price: 0.031; Device Package: 0603 (1608 Metric)
J4 J22 = 10118193-0001LF: CONN USB MICRO B RECPT SMT R/A; Part Number: 10118193-0001LF
LD11 = LTST-C191KGKT: LED GREEN CLEAR 0603 SMD; Manufacturer: Lite-On Inc.; Type: Surface Mount; Millicandela: 35mcd; Voltage Forward: 2V; Current (Test): 20mA; Viewing Angle: 130; Value: Green; Part Number: LTST-C191KGKT; PartId: 7051; Supplier 1: Digi-Key; Supplier Part Number 1: 160-1446-2-ND; ComponentLink1Description: Datasheet; ComponentLink1URL: http://optoelectronics.liteon.com/upload/download/DS22-2000-228/S_110_LTST-C191KGKT.pdf; ComponentLink2Description: Digi-Key Listing; ComponentLink2URL: http://www.digikey.ca/product-detail/en/LTST-C191KGKT/160-1446-2-ND/386835; Price: 0.0521; Device Package: 0603 (1608 Metric); Colour: Green; Lens Transparency: Clear
R30 = ERJ-2RKF1003X: RES SMD 100K OHM 1% 1/10W 0402; Manufacturer: Panasonic Electronic Components; TemperatureRange: -55C ~ 155C; TemperatureCoefficient: 100ppm/C; PowerRating: 0.1W, 1/10W; Value: 100k; Part Number: ERJ-2RKF1003X; PartId: 2; Supplier 1: Digi-Key; Supplier Part Number 1: P100KLTR-ND; ComponentLink1Description: Datasheet; ComponentLink1URL: http://industrial.panasonic.com/www-cgi/jvcr13pz.cgi?E+PZ+3+AOA0002+ERJ2RKF1003X+7+WW; ComponentLink2Description: Digikey listing; ComponentLink2URL: http://digikey.com/product-detail/en/ERJ-2RKF1003X/P100KLTR-ND/192081; Tolerance: 1%; Price: 0.0043; Type: Thick Film; Device Package: 0402 (1005 Metric)
R35 = ERJ-2RKF4702X: RES SMD 47K OHM 1% 1/10W 0402; Manufacturer: Panasonic Electronic Components; TemperatureRange: -55C ~ 155C; TemperatureCoefficient: 100ppm/C; PowerRating: 0.1W, 1/10W; Value: 47k; Part Number: ERJ-2RKF4702X; PartId: 22; Supplier 1: Digi-Key; Supplier Part Number 1: P47.0KLTR-ND; ComponentLink1Description: Datasheet; ComponentLink1URL: http://industrial.panasonic.com/www-cgi/jvcr13pz.cgi?E+PZ+3+AOA0002+ERJ2RKF4702X+7+WW; ComponentLink2Description: Digikey listing; ComponentLink2URL: http://digikey.com/product-detail/en/ERJ-2RKF4702X/P47.0KLTR-ND/1746233; Tolerance: 1%; Price: 0.0043; Type: Thick Film; Device Package: 0402 (1005 Metric)
R49 = ERJ-2RKF4700X: RES SMD 470 OHM 1% 1/10W 0402; Manufacturer: Panasonic Electronic Components; TemperatureRange: -55C ~ 155C; TemperatureCoefficient: 100ppm/C; PowerRating: 0.1W, 1/10W; Value: 470; Part Number: ERJ-2RKF4700X; PartId: 176; Supplier 1: Digi-Key; Supplier Part Number 1: P470LTR-ND; ComponentLink1Description: Datasheet; ComponentLink1URL: http://industrial.panasonic.com/www-cgi/jvcr13pz.cgi?E+PZ+3+AOA0002+ERJ2RKF4700X+7+WW; ComponentLink2Description: Digikey listing; ComponentLink2URL: http://digikey.com/product-detail/en/ERJ-2RKF4700X/P470LTR-ND/1746229; Tolerance: 1%; Price: 0.0043; Type: Thick Film; Device Package: 0402 (1005 Metric)
R54 R55 = ERJ-2RKF33R0X: RES SMD 33 OHM 1% 1/10W 0402; Manufacturer: Panasonic Electronic Components; TemperatureRange: -55C ~ 155C; TemperatureCoefficient: 100ppm/C; PowerRating: 0.1W, 1/10W; Value: 33; Part Number: ERJ-2RKF33R0X; PartId: 21; Supplier 1: Digi-Key; Supplier Part Number 1: P33.0LTR-ND; ComponentLink1Description: Datasheet; ComponentLink1URL: http://industrial.panasonic.com/www-cgi/jvcr13pz.cgi?E+PZ+3+AOA0002+ERJ2RKF33R0X+7+WW; ComponentLink2Description: Digikey listing; ComponentLink2URL: http://digikey.com/product-detail/en/ERJ-2RKF33R0X/P33.0LTR-ND/1746198; Tolerance: 1%; Price: 0.0043; Type: Thick Film; Device Package: 0402 (1005 Metric)
U13 = AP7313-18SAG-7: as U7 on sheet OSP_Carrier_V7_Release_Power; Part Number: AP7313-18SAG-7; PartId: 7912; Supplier 1: Digi-Key; Supplier Part Number 1: AP7313-18SAG-7DITR-ND; ComponentLink1Description: Datasheet; ComponentLink1URL: http://www.diodes.com/_files/datasheets/AP7313.pdf; ComponentLink2Description: Digi-Key Listing; ComponentLink2URL: http://www.digikey.ca/product-detail/en/AP7313-18SAG-7/AP7313-18SAG-7DITR-ND/2270804; Price: 0.1675; Device Package: TO-236-3, SC-59, SOT-23-3; Voltage Dropout: -; Operating Temperature: -40C ~ 85C
U14 = FTDI_FT234XD: FTDI FT234XD USB to UART

## Sheet OSP_Carrier_V7_Release_PMIC_Audio.SchDoc: OSP Full Carrier Board
size B; DrawnBy: LP; Revision: 1; SheetNumber: 5; SheetTotal: 7
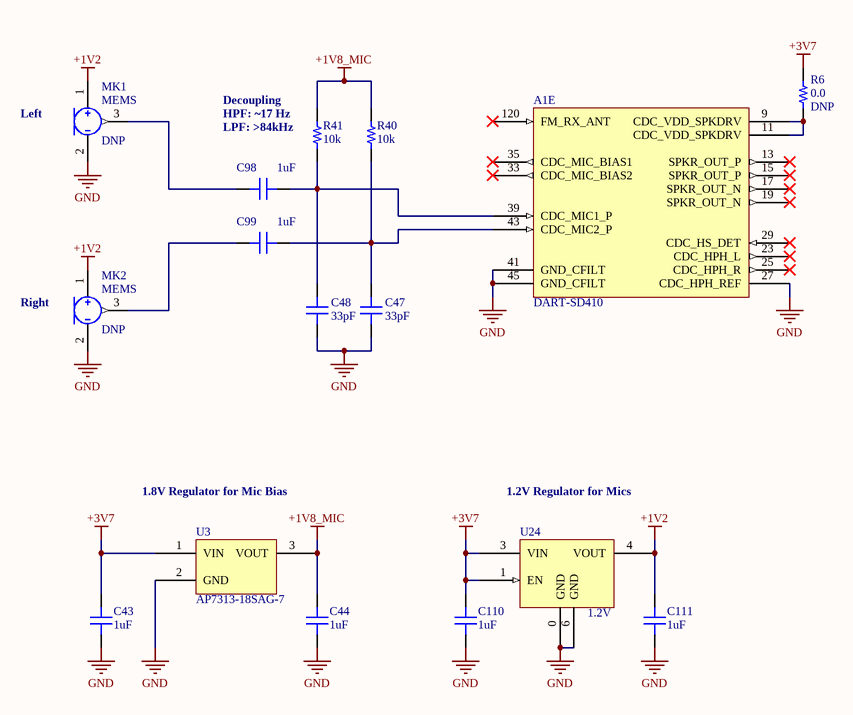
[diagram p3: OSP_Carrier_V7_Release_PMIC_Audio.SchDoc]

### Parts
A1  DART-SD410  [DART-SD410]  (part E of 15)
C43  1uF  [CAP 0402/1005]
C44  1uF  [CAP 0402/1005]
C47  33pF  [CAP 0402/1005]
C48  33pF  [CAP 0402/1005]
C98  1uF  [CAP 0603/1608]
C99  1uF  [CAP 0603/1608]
C110  1uF  [CAP 0402/1005]
C111  1uF  [CAP 0402/1005]
MK1  MEMS  [MEMS_MIC]
MK2  MEMS  [MEMS_MIC]
R6  0.0  [RES 0603/1608]
R40  10k  [RES 0402/1005]
R41  10k  [RES 0402/1005]
U3  AP7313-18SAG-7  [DIODES SOT-23-3]
U24  1.2V  [MICROCHIP_MIC5512]

### Nets
+1V2: C111.1 MK1.1(VDD) MK2.1(VDD) U24.4(VOUT)
+1V8_MIC: C44.1 R40.2 R41.2 U3.3(VOUT)
+3V7: C43.1 C110.1 R6.2 U3.1(VIN) U24.1(EN) U24.3(VIN)
GND: A1.27(CDC_HPH_REF) A1.41(GND_CFILT) A1.45(GND_CFILT) C43.2 C44.2 C47.1 C48.1 C110.2 C111.2 MK1.2(GND) MK2.2(GND) U3.2(GND) U24.0(GND) U24.6(GND)
NetA1_9: A1.9(CDC_VDD_SPKDRV) A1.11(CDC_VDD_SPKDRV) R6.1
NetA1_39: A1.39(CDC_MIC1_P) C48.2 C98.1 R41.1
NetA1_43: A1.43(CDC_MIC2_P) C47.2 C99.1 R40.1
NetC98_2: C98.2 MK1.3
NetC99_2: C99.2 MK2.3

Not connected (* = marked no-connect by the designer): A1 13(SPKR_OUT_P)* 15(SPKR_OUT_P)* 17(SPKR_OUT_N)* 19(SPKR_OUT_N)* 23(CDC_HPH_L)* 25(CDC_HPH_R)* 29(CDC_HS_DET)* 33(CDC_MIC_BIAS2)* 35(CDC_MIC_BIAS1)* 120(FM_RX_ANT)*

### Notes on the sheet
- (near MK1) Left
- (near R41) Decoupling
- (near R41) HPF: ~17 Hz
- (near R41) LPF: >84kHz
- (near MK2) Right
- 1.8V Regulator for Mic Bias
- 1.2V Regulator for Mics
- Title
- Size:
- Date:
- B
- Revision:
- Time:
- Drawn By:
- Approved:
- Sheet
- of
- LACI
- Atkinson Hall, 5202
- UC San Diego
- 9500 Gilman Drive #0436
- La Jolla, CA 92093-0436
- File:

### Library data of the parts
A1 = DART-SD410: Variscite DART-SD410 System on Module
C43 C44 C110 C111 = GRM155R61A105KE15D: as C2 on sheet OSP_Carrier_V7_Release_Power; Value: 1uF; Part Number: GRM155R61A105KE15D; PartId: 12338; Supplier 1: Digi-Key; Supplier Part Number 1: 490-3890-2-ND; ComponentLink1Description: Datasheet; ComponentLink1URL: http://www.murata.com/~/media/webrenewal/support/library/catalog/products/capacitor/mlcc/c02e.pdf; ComponentLink2Description: Digi-Key Listing; ComponentLink2URL: https://www.digikey.com/product-detail/en/murata-electronics-north-america/GRM155R61A105KE15D/490-3890-2-ND/965904; TemperatureCoefficient: X5R; Voltage: 10V; Price: 0.0069; Device Package: 0402 (1005 Metric)
C47 C48 = C1005C0G1H330J050BA: CAP CER 33PF 50V C0G 0402; Manufacturer: TDK Corporation; TemperatureRange: -55C ~ 125C; TemperatureCoefficient: C0G, NP0; Tolerance: 5%; Value: 33pF; Part Number: C1005C0G1H330J050BA; PartId: 3877; Supplier 1: Digi-Key; Supplier Part Number 1: 445-1241-2-ND; ComponentLink1Description: Datasheet; ComponentLink1URL: https://product.tdk.com/info/en/catalog/datasheets/mlcc_commercial_general_en.pdf; ComponentLink2Description: Digi-Key listing; ComponentLink2URL: http://digikey.com/product-detail/en/C1005C0G1H330J050BA/445-1241-2-ND/513687; Voltage: 50V; Price: 0.006; Type: -; Device Package: 0402 (1005 Metric)
C98 C99 = C1608X7R1E105K080AB: as C70 on sheet OSP_Carrier_V7_Release_USB; Value: 1uF; Part Number: C1608X7R1E105K080AB; PartId: 4041; Supplier 1: Digi-Key; Supplier Part Number 1: 445-5956-1-ND; ComponentLink1Description: Datasheet; ComponentLink1URL: https://product.tdk.com/info/en/catalog/datasheets/mlcc_commercial_general_en.pdf; ComponentLink2Description: Digi-Key listing; ComponentLink2URL: http://digikey.com/product-detail/en/C1608X7R1E105K080AB/445-5956-1-ND/2443997; TemperatureCoefficient: X7R; Voltage: 25V; Price: 0.27; Type: -; Device Package: 0603 (1608 Metric)
MK1 MK2 = Mems_Mic: Generic 3-pin bottom mount MEMS mic; DNP: DNP
R6 = CRCW06030000Z0EAHP: RES SMD 0.0 OHM JUMPER 1/4W 0603; Manufacturer: Vishay Dale; TemperatureRange: -55C ~ 155C; PowerRating: 0.25W, 1/4W; Value: 0.0; Part Number: CRCW06030000Z0EAHP; PartId: 16113; Supplier 1: Digi-Key; Supplier Part Number 1: 541-0.0SBTR-ND; ComponentLink1Description: Datasheet; ComponentLink1URL: http://www.vishay.com/docs/20043/crcwhpe3.pdf; ComponentLink2Description: Digi-Key Listing; ComponentLink2URL: https://www.digikey.com/product-detail/en/vishay-dale/CRCW06030000Z0EAHP/541-0.0SBTR-ND/2222231; Tolerance: Jumper; Price: 0.0238; Device Package: 0603 (1608 Metric); DNP: DNP
R40 R41 = ERJ-2RKF1002X: as R4 on sheet OSP_Carrier_V7_Release_DJB; Value: 10k; Part Number: ERJ-2RKF1002X; PartId: 1; Supplier 1: Digi-Key; Supplier Part Number 1: P10.0KLTR-ND; ComponentLink1Description: Datasheet; ComponentLink1URL: http://industrial.panasonic.com/www-cgi/jvcr13pz.cgi?E+PZ+3+AOA0002+ERJ2RKF1002X+7+WW; ComponentLink2Description: Digikey listing; ComponentLink2URL: http://digikey.com/product-detail/en/ERJ-2RKF1002X/P10.0KLTR-ND/192073; Tolerance: 1%; Price: 0.0043; Type: Thick Film; Device Package: 0402 (1005 Metric)
U3 = AP7313-18SAG-7: as U7 on sheet OSP_Carrier_V7_Release_Power; Part Number: AP7313-18SAG-7; PartId: 7912; Supplier 1: Digi-Key; Supplier Part Number 1: AP7313-18SAG-7DITR-ND; ComponentLink1Description: Datasheet; ComponentLink1URL: http://www.diodes.com/_files/datasheets/AP7313.pdf; ComponentLink2Description: Digi-Key Listing; ComponentLink2URL: http://www.digikey.ca/product-detail/en/AP7313-18SAG-7/AP7313-18SAG-7DITR-ND/2270804; Price: 0.1675; Device Package: TO-236-3, SC-59, SOT-23-3; Voltage - Output: 1.8V; Voltage Dropout: -; Operating Temperature: -40C ~ 85C
U24 = Microchip_MIC5512-1.2YMT: Microchip MIC5512-1.2YMT 1.2V 300mA linear regulator

## Sheet OSP_Carrier_V7_Release_Misc.SchDoc: OSP Full Carrier Board
size B; DrawnBy: LP; Revision: 1; SheetNumber: 6; SheetTotal: 7
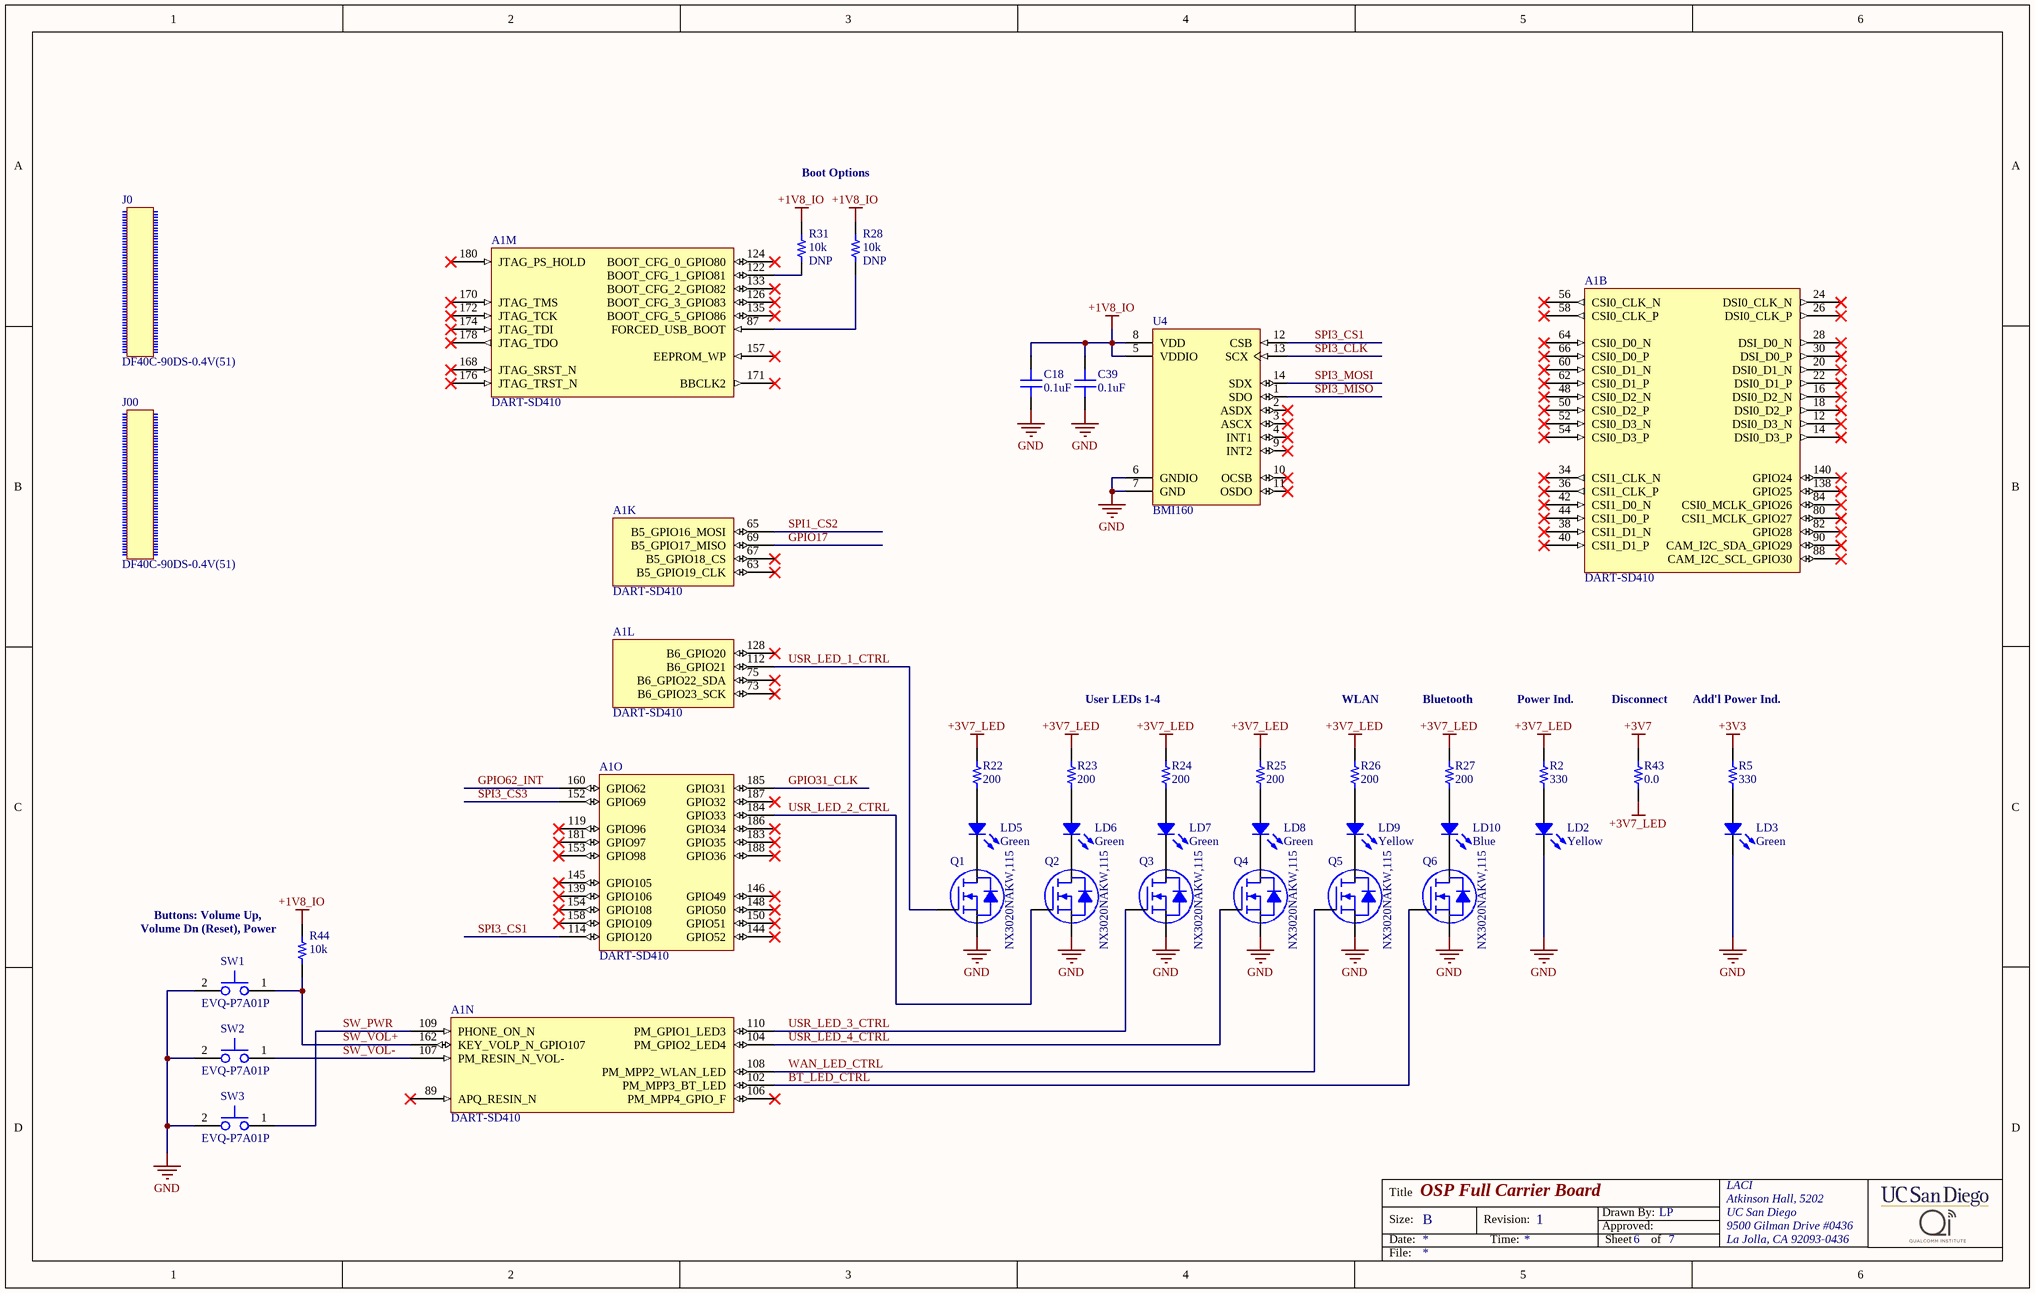
[diagram p4: OSP_Carrier_V7_Release_Misc.SchDoc]

### Parts
A1  DART-SD410  [DART-SD410]  (parts B,K,L,M,N,O of 15)
C18  0.1uF  [CAP 0402/1005]
C39  0.1uF  [CAP 0402/1005]
J0  DF40C-90DS-0.4V(51)  [Hirose_DF40C-90DS-0.4V(51)]
J00  DF40C-90DS-0.4V(51)  [Hirose_DF40C-90DS-0.4V(51)]
LD2  Yellow  [LED 0603/1608 YELLOW]
LD3  Green  [LED 0603/1608 GREEN]
LD5  Green  [LED 0603/1608 GREEN]
LD6  Green  [LED 0603/1608 GREEN]
LD7  Green  [LED 0603/1608 GREEN]
LD8  Green  [LED 0603/1608 GREEN]
LD9  Yellow  [LED 0603/1608 YELLOW]
LD10  Blue  [LED 0603/1608 BLUE]
Q1  NX3020NAKW,115  [NXP SOT-323-3]
Q2  NX3020NAKW,115  [NXP SOT-323-3]
Q3  NX3020NAKW,115  [NXP SOT-323-3]
Q4  NX3020NAKW,115  [NXP SOT-323-3]
Q5  NX3020NAKW,115  [NXP SOT-323-3]
Q6  NX3020NAKW,115  [NXP SOT-323-3]
R2  330  [RES 0402/1005]
R5  330  [RES 0402/1005]
R22  200  [RES 0402/1005]
R23  200  [RES 0402/1005]
R24  200  [RES 0402/1005]
R25  200  [RES 0402/1005]
R26  200  [RES 0402/1005]
R27  200  [RES 0402/1005]
R28  10k  [RES 0402/1005]
R31  10k  [RES 0402/1005]
R43  0.0  [RES 0603/1608]
R44  10k  [RES 0402/1005]
SW1  EVQ-P7A01P  [PANASONIC_EVQ-P7A]
SW2  EVQ-P7A01P  [PANASONIC_EVQ-P7A]
SW3  EVQ-P7A01P  [PANASONIC_EVQ-P7A]
U4  BMI160  [BOSCH_LGA14]

### Nets
+1V8_IO: C18.1 C39.1 R28.2 R31.2 R44.2 U4.5(VDDIO) U4.8(VDD)
+3V3: R5.1
+3V7: R43.2
+3V7_LED: R2.1 R22.2 R23.2 R24.2 R25.2 R26.2 R27.2 R43.1
GND: C18.2 C39.2 LD2.2 LD3.2 Q1.3(S) Q2.3(S) Q3.3(S) Q4.3(S) Q5.3(S) Q6.3(S) SW1.2 SW2.2 SW3.2 U4.6(GNDIO) U4.7(GND)
BT_LED_CTRL: A1.102(PM_MPP3_BT_LED) Q6.1(G)
GPIO17: A1.69(B5_GPIO17_MISO)
GPIO31_CLK: A1.185(GPIO31)
GPIO62_INT: A1.160(GPIO62)
SPI1_CS2: A1.65(B5_GPIO16_MOSI)
SPI3_CLK: U4.13(SCX)
SPI3_CS1: A1.114(GPIO120) U4.12(CSB)
SPI3_CS3: A1.152(GPIO69)
SPI3_MISO: U4.1(SDO)
SPI3_MOSI: U4.14(SDX)
SW_PWR: A1.109(PHONE_ON_N) SW3.1
SW_VOL+: A1.162(KEY_VOLP_N_GPIO107) R44.1 SW1.1
SW_VOL-: A1.107(PM_RESIN_N_VOL-) SW2.1
USR_LED_1_CTRL: A1.112(B6_GPIO21) Q1.1(G)
USR_LED_2_CTRL: A1.184(GPIO33) Q2.1(G)
USR_LED_3_CTRL: A1.110(PM_GPIO1_LED3) Q3.1(G)
USR_LED_4_CTRL: A1.104(PM_GPIO2_LED4) Q4.1(G)
WAN_LED_CTRL: A1.108(PM_MPP2_WLAN_LED) Q5.1(G)
NetA1_87: A1.87(FORCED_USB_BOOT) R28.1
NetA1_122: A1.122(BOOT_CFG_1_GPIO81) R31.1
NetLD2_1: LD2.1 R2.2
NetLD3_1: LD3.1 R5.2
NetLD5_1: LD5.1 R22.1
NetLD5_2: LD5.2 Q1.2(D)
NetLD6_1: LD6.1 R23.1
NetLD6_2: LD6.2 Q2.2(D)
NetLD7_1: LD7.1 R24.1
NetLD7_2: LD7.2 Q3.2(D)
NetLD8_1: LD8.1 R25.1
NetLD8_2: LD8.2 Q4.2(D)
NetLD9_1: LD9.1 R26.1
NetLD9_2: LD9.2 Q5.2(D)
NetLD10_1: LD10.1 R27.1
NetLD10_2: LD10.2 Q6.2(D)

Not connected (* = marked no-connect by the designer): A1 12(DSI0_D3_N)* 14(DSI0_D3_P)* 16(DSI0_D2_N)* 18(DSI0_D2_P)* 20(DSI0_D1_N)* 22(DSI0_D1_P)* 24(DSI0_CLK_N)* 26(DSI0_CLK_P)* 28(DSI_D0_N)* 30(DSI_D0_P)* 34(CSI1_CLK_N)* 36(CSI1_CLK_P)* 38(CSI1_D1_N)* 40(CSI1_D1_P)* 42(CSI1_D0_N)* 44(CSI1_D0_P)* 48(CSI0_D2_N)* 50(CSI0_D2_P)* 52(CSI0_D3_N)* 54(CSI0_D3_P)* 56(CSI0_CLK_N)* 58(CSI0_CLK_P)* 60(CSI0_D1_N)* 62(CSI0_D1_P)* 63(B5_GPIO19_CLK)* 64(CSI0_D0_N)* 66(CSI0_D0_P)* 67(B5_GPIO18_CS)* 73(B6_GPIO23_SCK)* 75(B6_GPIO22_SDA)* 80(CSI1_MCLK_GPIO27)* 82(GPIO28)* 84(CSI0_MCLK_GPIO26)* 88(CAM_I2C_SCL_GPIO30)* 89(APQ_RESIN_N)* 90(CAM_I2C_SDA_GPIO29)* 106(PM_MPP4_GPIO_F)* 119(GPIO96)* 124(BOOT_CFG_0_GPIO80)* 126(BOOT_CFG_3_GPIO83)* 128(B6_GPIO20)* 133(BOOT_CFG_2_GPIO82)* 135(BOOT_CFG_5_GPIO86)* 138(GPIO25)* 139(GPIO106)* 140(GPIO24)* 144(GPIO52)* 145(GPIO105)* 146(GPIO49)* 148(GPIO50)* 150(GPIO51)* 153(GPIO98)* 154(GPIO108)* 157(EEPROM_WP)* 158(GPIO109)* 168(JTAG_SRST_N)* 170(JTAG_TMS)* 171(BBCLK2)* 172(JTAG_TCK)* 174(JTAG_TDI)* 176(JTAG_TRST_N)* 178(JTAG_TDO)* 180(JTAG_PS_HOLD)* 181(GPIO97)* 183(GPIO35)* 186(GPIO34)* 187(GPIO32)* 188(GPIO36)*; U4 2(ASDX)* 3(ASCX)* 4(INT1)* 9(INT2)* 10(OCSB)* 11(OSDO)*

### Notes on the sheet
- Boot Options
- User LEDs 1-4
- WLAN
- Bluetooth
- Power Ind.
- Disconnect
- Add'l Power Ind.
- (near R44) Volume Dn (Reset), Power
- (near R44) Buttons: Volume Up,
- Title
- Size:
- Date:
- B
- Revision:
- Time:
- Drawn By:
- Approved:
- Sheet
- of
- LACI
- Atkinson Hall, 5202
- UC San Diego
- 9500 Gilman Drive #0436
- La Jolla, CA 92093-0436
- File:

### Library data of the parts
A1 = DART-SD410: Variscite DART-SD410 System on Module
C18 C39 = C1005X7R1H104K050BB: as C3 on sheet OSP_Carrier_V7_Release_Power; Value: 0.1uF; Part Number: C1005X7R1H104K050BB; PartId: 3860; Supplier 1: Digi-Key; Supplier Part Number 1: 445-5932-2-ND; ComponentLink1Description: Datasheet; ComponentLink1URL: https://product.tdk.com/info/en/catalog/datasheets/mlcc_commercial_general_en.pdf; ComponentLink2Description: Digi-Key listing; ComponentLink2URL: http://digikey.com/product-detail/en/C1005X7R1H104K050BB/445-5932-2-ND/2443410; TemperatureCoefficient: X7R; Voltage: 50V; Price: 0.0287; Type: -; Device Package: 0402 (1005 Metric)
J0 J00 = Dummy_Hirose_SoM_Connector: Hirose DF40C-90DS-0.4V(51) Board-to-Board Connector
LD2 LD9 = LTST-C191KSKT: LED YELLOW CLEAR 0603 SMD; Manufacturer: Lite-On Inc.; Value: Green; Type: Surface Mount; Millicandela: 104mcd; Voltage Forward: 2.1V; Current (Test): 20mA; Viewing Angle: 130; Part Number: LTST-C191KSKT; PartId: 7053; Supplier 1: Digi-Key; Supplier Part Number 1: 160-1448-2-ND; ComponentLink1Description: Datasheet; ComponentLink1URL: http://optoelectronics.liteon.com/upload/download/DS22-2000-224/S_110_LTST-C191KSKT.pdf; ComponentLink2Description: Digi-Key Listing; ComponentLink2URL: http://www.digikey.ca/product-detail/en/LTST-C191KSKT/160-1448-2-ND/386839; Price: 0.0555; Device Package: 0603 (1608 Metric); Colour: Yellow; Lens Transparency: Clear
LD3 LD5-LD8 = LTST-C191KGKT: as LD11 on sheet OSP_Carrier_V7_Release_USB; Value: Green; Part Number: LTST-C191KGKT; PartId: 7051; Supplier 1: Digi-Key; Supplier Part Number 1: 160-1446-2-ND; ComponentLink1Description: Datasheet; ComponentLink1URL: http://optoelectronics.liteon.com/upload/download/DS22-2000-228/S_110_LTST-C191KGKT.pdf; ComponentLink2Description: Digi-Key Listing; ComponentLink2URL: http://www.digikey.ca/product-detail/en/LTST-C191KGKT/160-1446-2-ND/386835; Price: 0.0521; Device Package: 0603 (1608 Metric); Colour: Green; Lens Transparency: Clear
LD10 = LTST-C193TBKT-5A: LED BLUE CLEAR 0603 SMD; Manufacturer: Lite-On Inc.; Value: Green; Type: Surface Mount; Millicandela: 15mcd; Voltage Forward: 2.8V; Current (Test): 5mA; Viewing Angle: 130; Part Number: LTST-C193TBKT-5A; PartId: 7054; Supplier 1: Digi-Key; Supplier Part Number 1: 160-1827-2-ND; ComponentLink1Description: Datasheet; ComponentLink1URL: http://optoelectronics.liteon.com/upload/download/DS22-2004-060/P_100_LTST-C193TBKT-5A.pdf; ComponentLink2Description: Digi-Key Listing; ComponentLink2URL: http://www.digikey.ca/product-detail/en/LTST-C193TBKT-5A/160-1827-2-ND/2053656; Price: 0.0875; Device Package: 0603 (1608 Metric); Colour: Blue; Lens Transparency: Clear
Q1-Q6 = NX3020NAKW,115: MOSFET N-CH 30V 180MA SOT323; Part Number: NX3020NAKW,115
R2 R5 = ERJ-2RKF3300X: RES SMD 330 OHM 1% 1/10W 0402; Manufacturer: Panasonic Electronic Components; TemperatureRange: -55C ~ 155C; TemperatureCoefficient: 100ppm/C; PowerRating: 0.1W, 1/10W; Value: 330; Part Number: ERJ-2RKF3300X; PartId: 165; Supplier 1: Digi-Key; Supplier Part Number 1: P330LTR-ND; ComponentLink1Description: Datasheet; ComponentLink1URL: http://industrial.panasonic.com/www-cgi/jvcr13pz.cgi?E+PZ+3+AOA0002+ERJ2RKF3300X+7+WW; ComponentLink2Description: Digikey listing; ComponentLink2URL: http://digikey.com/product-detail/en/ERJ-2RKF3300X/P330LTR-ND/1746189; Tolerance: 1%; Price: 0.0043; Type: Thick Film; Device Package: 0402 (1005 Metric)
R22-R27 = ERJ-2RKF2000X: RES SMD 200 OHM 1% 1/10W 0402; Manufacturer: Panasonic Electronic Components; TemperatureRange: -55C ~ 155C; TemperatureCoefficient: 100ppm/C; PowerRating: 0.1W, 1/10W; Value: 200; Part Number: ERJ-2RKF2000X; PartId: 12; Supplier 1: Digi-Key; Supplier Part Number 1: P200LTR-ND; ComponentLink1Description: Datasheet; ComponentLink1URL: http://industrial.panasonic.com/www-cgi/jvcr13pz.cgi?E+PZ+3+AOA0002+ERJ2RKF2000X+7+WW; ComponentLink2Description: Digikey listing; ComponentLink2URL: http://digikey.com/product-detail/en/ERJ-2RKF2000X/P200LTR-ND/192215; Tolerance: 1%; Price: 0.0043; Type: Thick Film; Device Package: 0402 (1005 Metric)
R28 R31 R44 = ERJ-2RKF1002X: as R4 on sheet OSP_Carrier_V7_Release_DJB; Value: 10k; Part Number: ERJ-2RKF1002X; PartId: 1; Supplier 1: Digi-Key; Supplier Part Number 1: P10.0KLTR-ND; ComponentLink1Description: Datasheet; ComponentLink1URL: http://industrial.panasonic.com/www-cgi/jvcr13pz.cgi?E+PZ+3+AOA0002+ERJ2RKF1002X+7+WW; ComponentLink2Description: Digikey listing; ComponentLink2URL: http://digikey.com/product-detail/en/ERJ-2RKF1002X/P10.0KLTR-ND/192073; Tolerance: 1%; Price: 0.0043; Type: Thick Film; Device Package: 0402 (1005 Metric)
  R28 R31: DNP: DNP
R43 = CRCW06030000Z0EAHP: as R6 on sheet OSP_Carrier_V7_Release_PMIC_Audio; Value: 0.0; Part Number: CRCW06030000Z0EAHP; PartId: 16113; Supplier 1: Digi-Key; Supplier Part Number 1: 541-0.0SBTR-ND; ComponentLink1Description: Datasheet; ComponentLink1URL: http://www.vishay.com/docs/20043/crcwhpe3.pdf; ComponentLink2Description: Digi-Key Listing; ComponentLink2URL: https://www.digikey.com/product-detail/en/vishay-dale/CRCW06030000Z0EAHP/541-0.0SBTR-ND/2222231; Tolerance: Jumper; Price: 0.0238; Device Package: 0603 (1608 Metric)
SW1-SW3 = PANASONIC_EVQ-P7A01P: Tact Switch SMT Right Angle
U4 = BOSCH_BMI160: BMI160 2.5 x 3 mm Tiaxial Accelerometer / Gyroscope Inertial Measurement Unit